# Altium project HIVE_BOARD.PrjPcb (part 4 of 6)

## Sheet HIVE_BOARD_CHANNEL_HW.SchDoc
size 647 x 419 mm; SheetNumber: 7; SheetTotal: 12; Sheet_Name: CHANNEL HARDWARE & CONNECTOR; Size: 11x17
Used 3 times, as channels TOP/CHAN 0A + 1A, TOP/CHAN 0B + 1B, TOP/CHAN 0C + 1C. Parts and nets are listed once, with the designators drawn on the sheet.
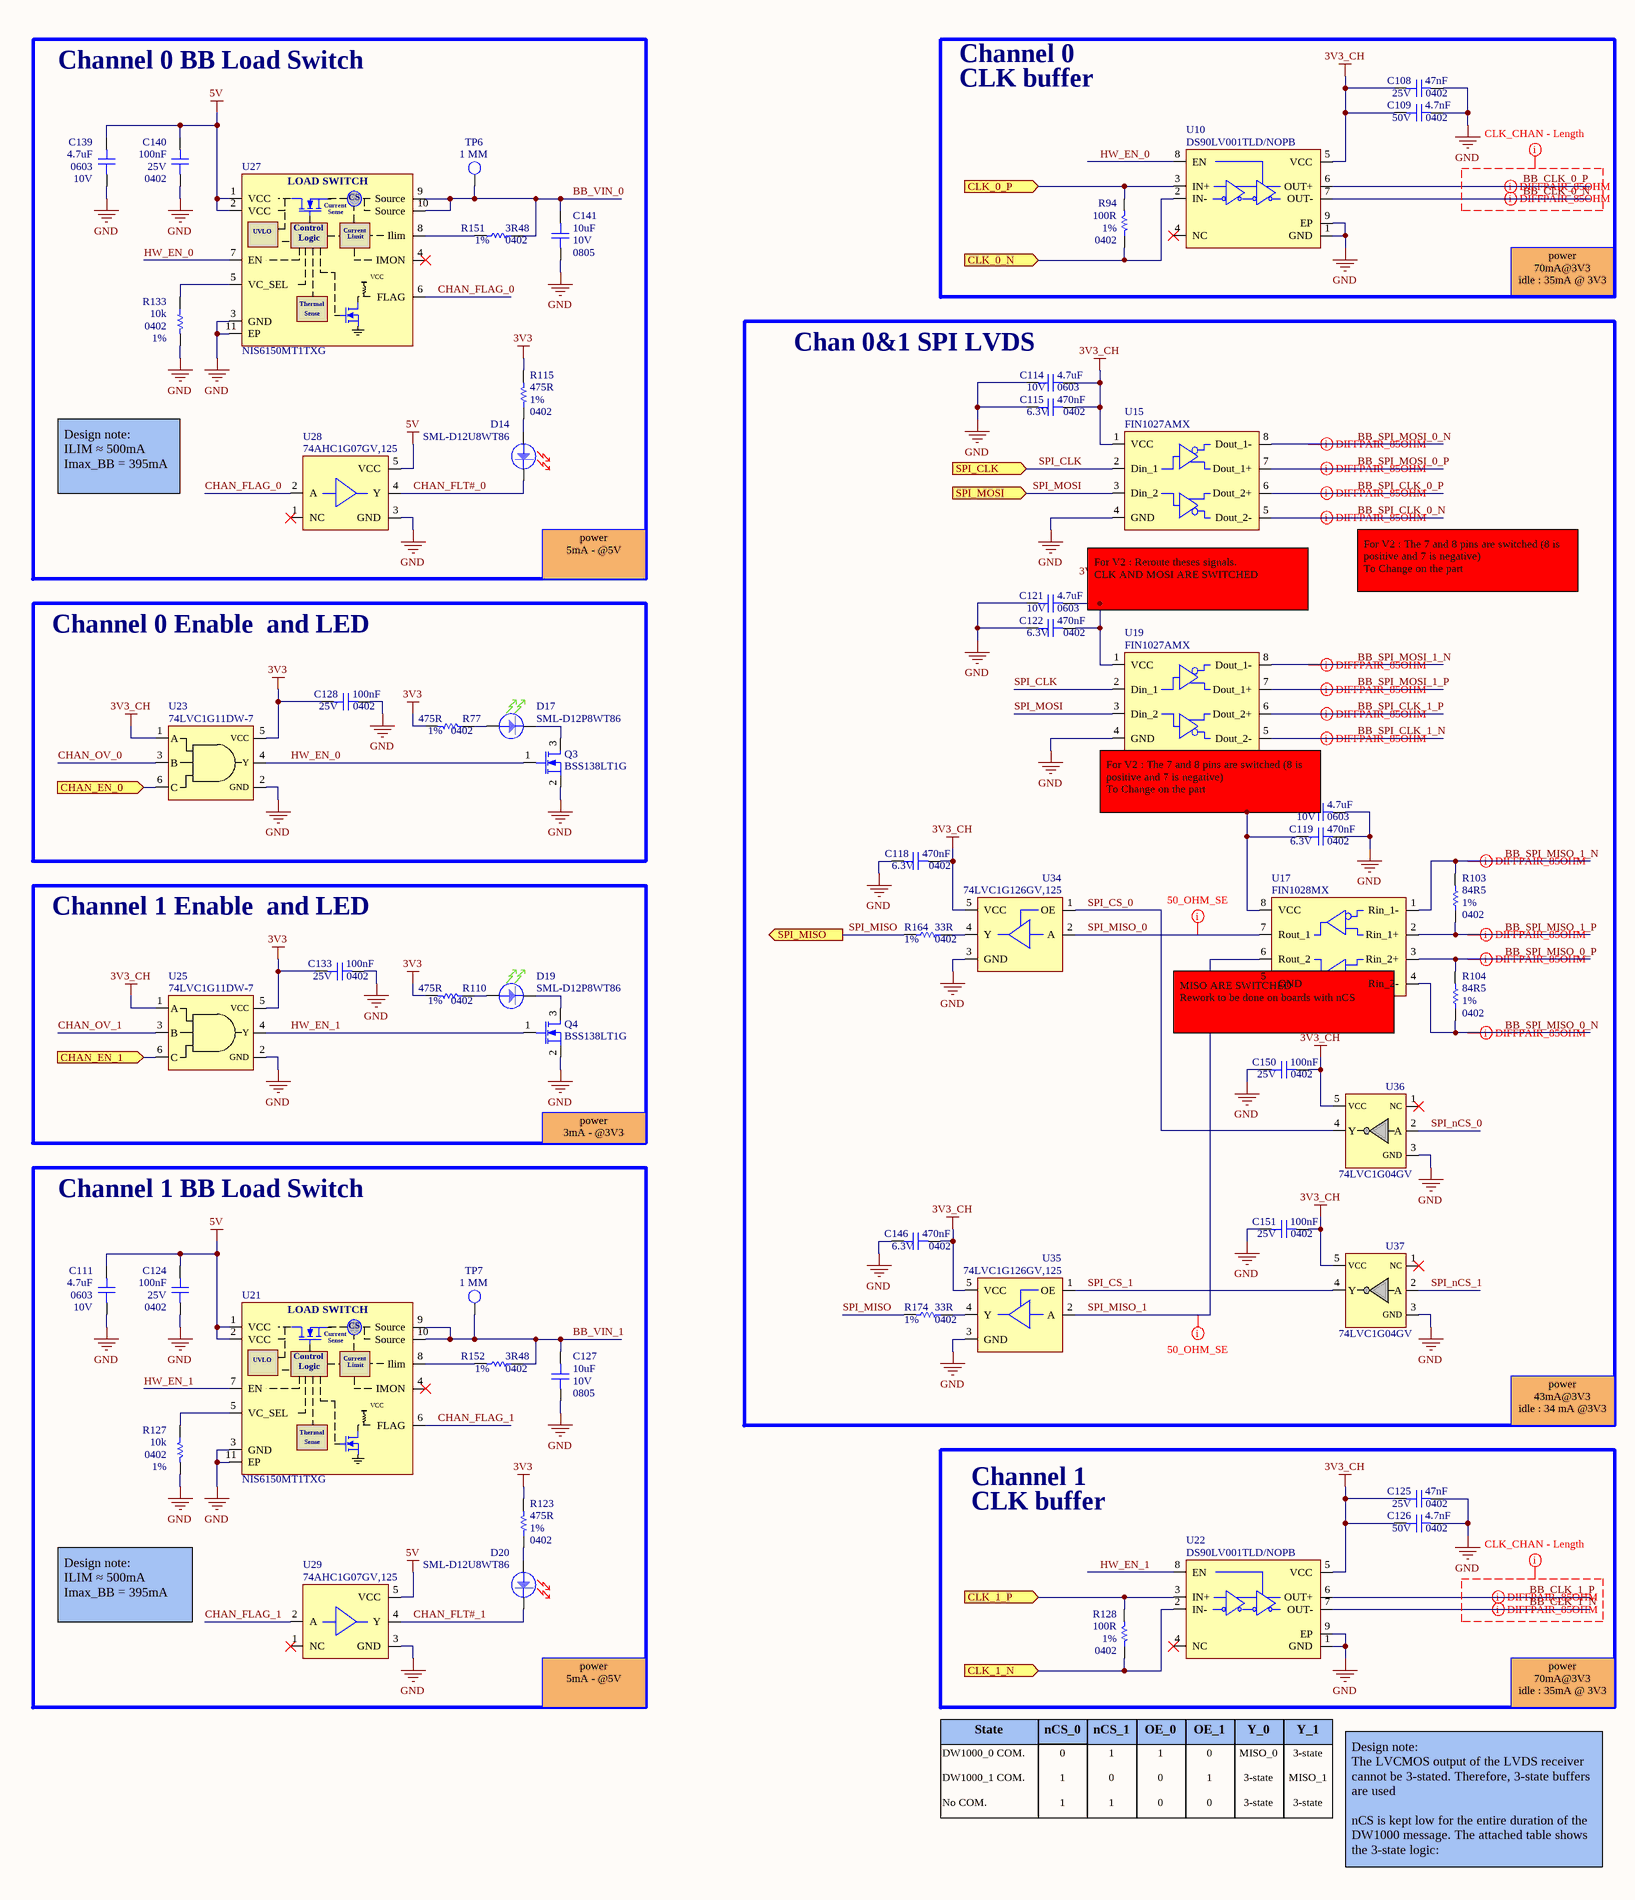
[diagram p5: HIVE_BOARD_CHANNEL_HW.SchDoc, left]
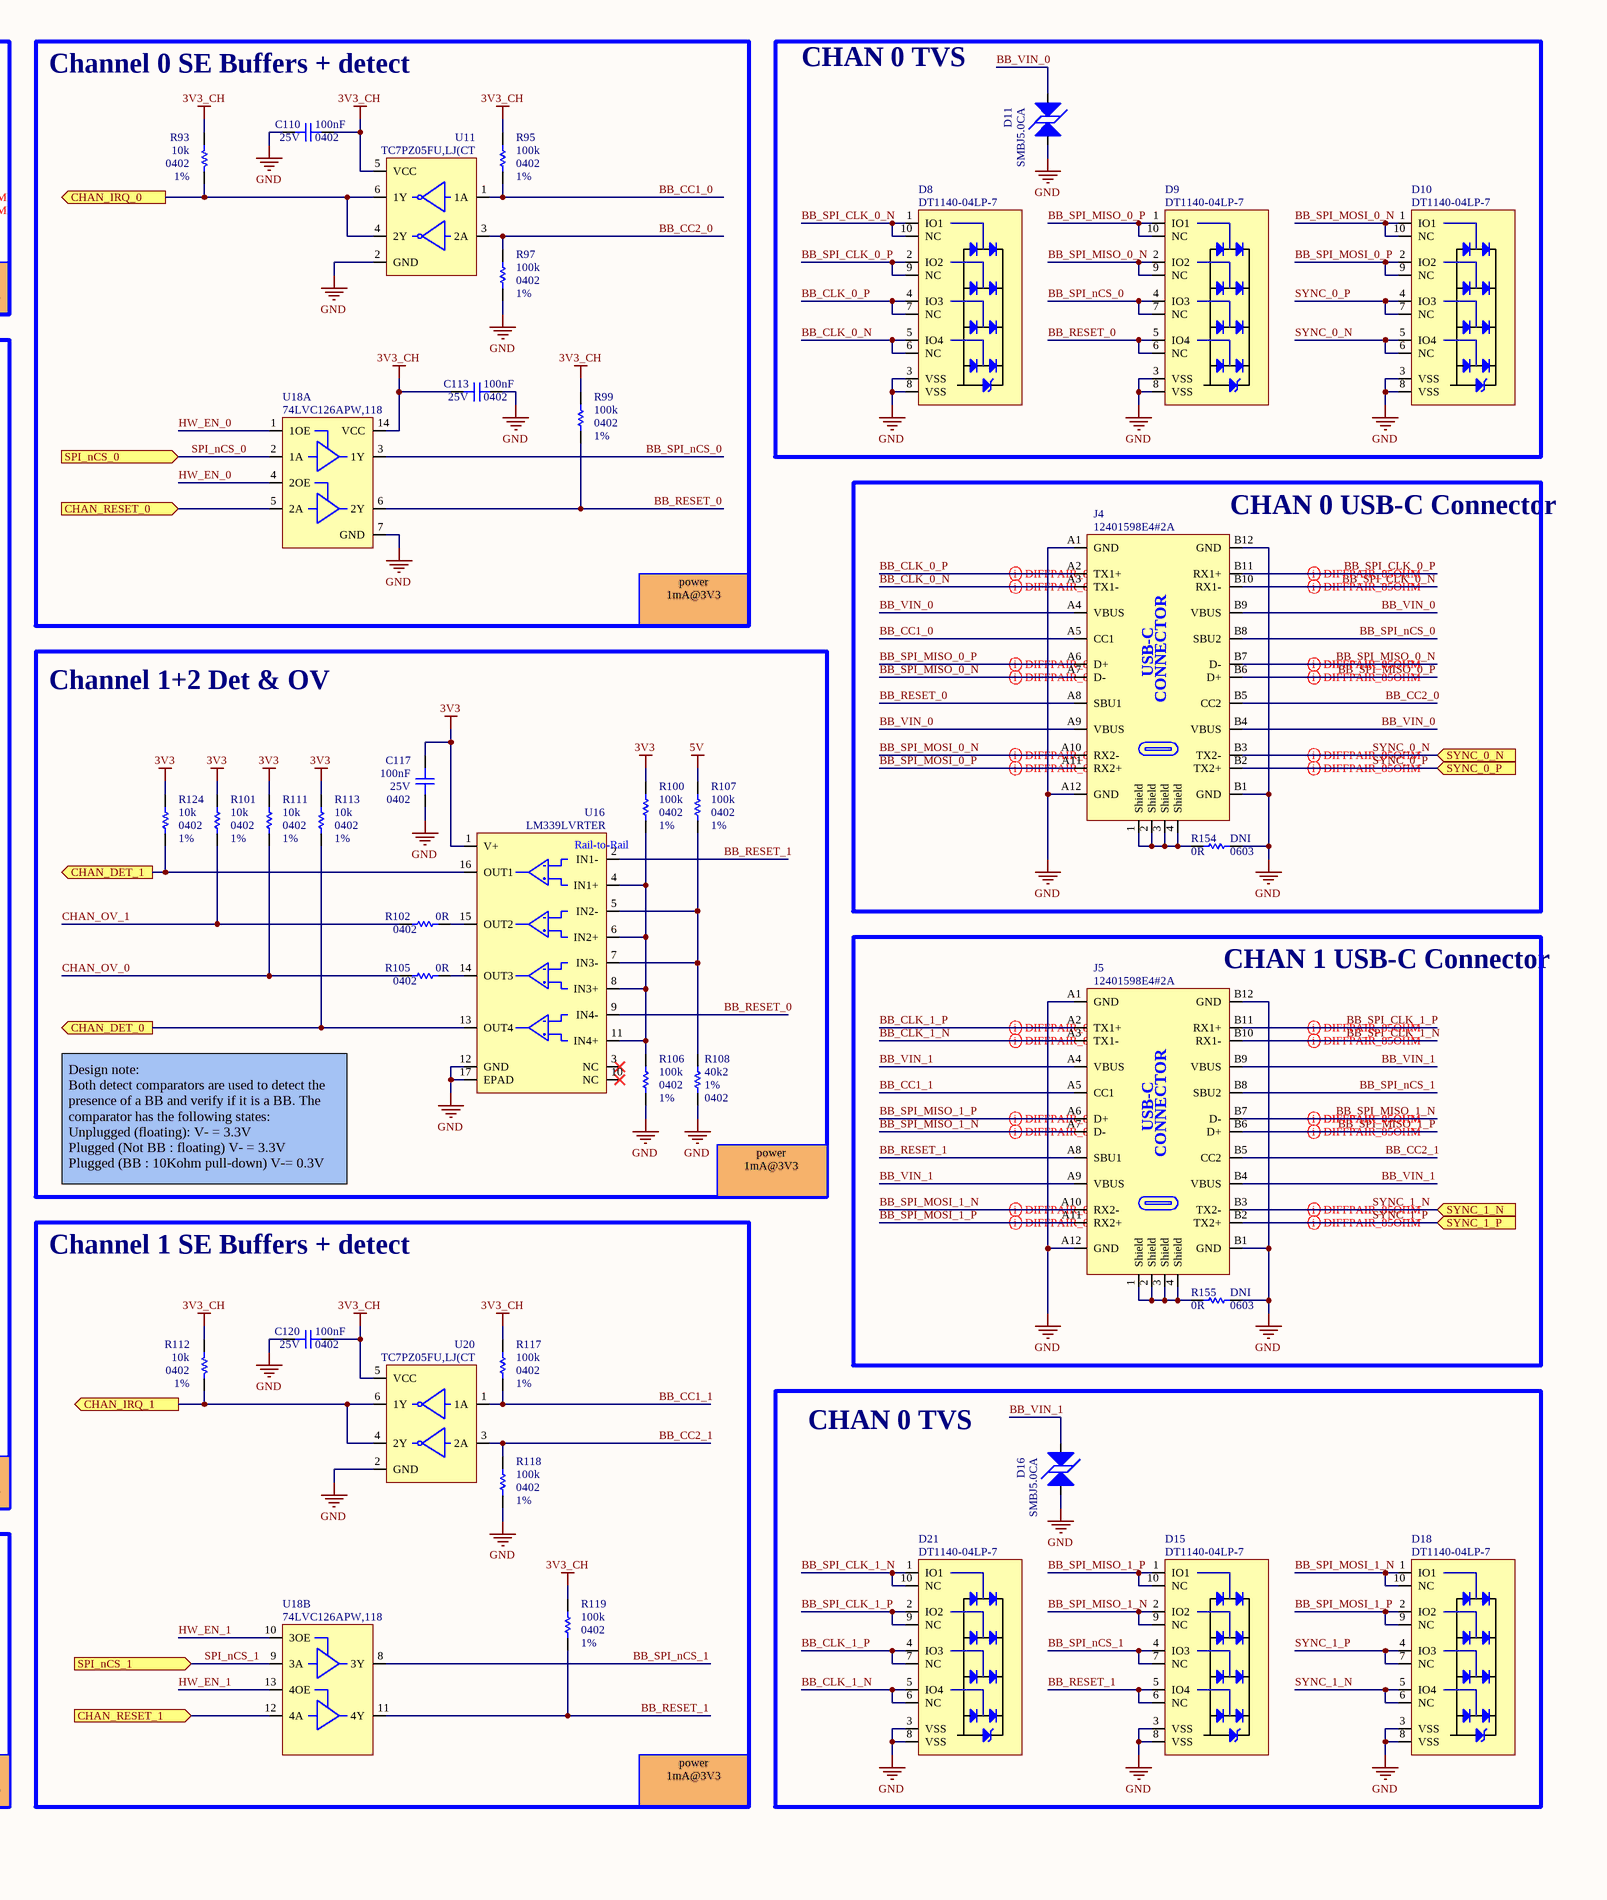
[diagram p6: HIVE_BOARD_CHANNEL_HW.SchDoc, right]

### Parts
C108  value 47nF  Package: 0402  Voltage Rating: 25V  [CAP_CER_0402]  (hidden comment: GRM155R71E473KA88J)
C109  value 4.7nF  Package: 0402  Voltage Rating: 50V  [CAP_CER_0402]  (hidden comment: CL05B472KB5VPNC)
C110  value 100nF  Package: 0402  Voltage Rating: 25V  [CAP_CER_0402]  (hidden comment: CGA2B3X7R1E104K050BB)
C111  value 4.7uF  Package: 0603  Voltage Rating: 10V  [CAP_CER_0603]  (hidden comment: CL10A475KP8NNNC)
C113  value 100nF  Package: 0402  Voltage Rating: 25V  [CAP_CER_0402]  (hidden comment: CGA2B3X7R1E104K050BB)
C114  value 4.7uF  Package: 0603  Voltage Rating: 10V  [CAP_CER_0603]  (hidden comment: CL10A475KP8NNNC)
C115  value 470nF  Package: 0402  Voltage Rating: 6.3V  [CAP_CER_0402]  (hidden comment: JMK105B7474KVHF)
C117  value 100nF  Package: 0402  Voltage Rating: 25V  [CAP_CER_0402]  (hidden comment: CGA2B3X7R1E104K050BB)
C118  value 470nF  Package: 0402  Voltage Rating: 6.3V  [CAP_CER_0402]  (hidden comment: JMK105B7474KVHF)
C119  value 470nF  Package: 0402  Voltage Rating: 6.3V  [CAP_CER_0402]  (hidden comment: JMK105B7474KVHF)
C120  value 100nF  Package: 0402  Voltage Rating: 25V  [CAP_CER_0402]  (hidden comment: CGA2B3X7R1E104K050BB)
C121  value 4.7uF  Package: 0603  Voltage Rating: 10V  [CAP_CER_0603]  (hidden comment: CL10A475KP8NNNC)
C122  value 470nF  Package: 0402  Voltage Rating: 6.3V  [CAP_CER_0402]  (hidden comment: JMK105B7474KVHF)
C124  value 100nF  Package: 0402  Voltage Rating: 25V  [CAP_CER_0402]  (hidden comment: CGA2B3X7R1E104K050BB)
C125  value 47nF  Package: 0402  Voltage Rating: 25V  [CAP_CER_0402]  (hidden comment: GRM155R71E473KA88J)
C126  value 4.7nF  Package: 0402  Voltage Rating: 50V  [CAP_CER_0402]  (hidden comment: CL05B472KB5VPNC)
C127  value 10uF  Package: 0805  Voltage Rating: 10V  [CAP_CER_0805]  (hidden comment: LMK212BJ106KG-T)
C128  value 100nF  Package: 0402  Voltage Rating: 25V  [CAP_CER_0402]  (hidden comment: CGA2B3X7R1E104K050BB)
C133  value 100nF  Package: 0402  Voltage Rating: 25V  [CAP_CER_0402]  (hidden comment: CGA2B3X7R1E104K050BB)
C139  value 4.7uF  Package: 0603  Voltage Rating: 10V  [CAP_CER_0603]  (hidden comment: CL10A475KP8NNNC)
C140  value 100nF  Package: 0402  Voltage Rating: 25V  [CAP_CER_0402]  (hidden comment: CGA2B3X7R1E104K050BB)
C141  value 10uF  Package: 0805  Voltage Rating: 10V  [CAP_CER_0805]  (hidden comment: LMK212BJ106KG-T)
C145  value 4.7uF  Package: 0603  Voltage Rating: 10V  [CAP_CER_0603]  (hidden comment: CL10A475KP8NNNC)
C146  value 470nF  Package: 0402  Voltage Rating: 6.3V  [CAP_CER_0402]  (hidden comment: JMK105B7474KVHF)
C150  value 100nF  Package: 0402  Voltage Rating: 25V  [CAP_CER_0402]  (hidden comment: CGA2B3X7R1E104K050BB)
C151  value 100nF  Package: 0402  Voltage Rating: 25V  [CAP_CER_0402]  (hidden comment: CGA2B3X7R1E104K050BB)
D8  DT1140-04LP-7  [TVS_DATA_DT1140-04LP-7]
D9  DT1140-04LP-7  [TVS_DATA_DT1140-04LP-7]
D10  DT1140-04LP-7  [TVS_DATA_DT1140-04LP-7]
D11  SMBJ5.0CA  [TVS_PWR_SMBJ5.0CA]
D14  SML-D12U8WT86  [LED_SML-D12U8WT86]
D15  DT1140-04LP-7  [TVS_DATA_DT1140-04LP-7]
D16  SMBJ5.0CA  [TVS_PWR_SMBJ5.0CA]
D17  SML-D12P8WT86  [LED_SML-D12P8WT86]
D18  DT1140-04LP-7  [TVS_DATA_DT1140-04LP-7]
D19  SML-D12P8WT86  [LED_SML-D12P8WT86]
D20  SML-D12U8WT86  [LED_SML-D12U8WT86]
D21  DT1140-04LP-7  [TVS_DATA_DT1140-04LP-7]
J4  12401598E4#2A  [CON_USB_3.2_TypeC_12401598E4#2A]
J5  12401598E4#2A  [CON_USB_3.2_TypeC_12401598E4#2A]
Q3  BSS138LT1G  [TRX_NMOS_BSS138LT1G]
Q4  BSS138LT1G  [TRX_NMOS_BSS138LT1G]
R77  value 475R  Tolerance: 1%  Package: 0402  [RES_0402]  (hidden comment: ERJ-2RKF4750X)
R93  value 10k  Tolerance: 1%  Package: 0402  [RES_0402]  (hidden comment: RC0402FR-0710KL)
R94  value 100R  Tolerance: 1%  Package: 0402  [RES_0402]  (hidden comment: RC0402FR-07100RP)
R95  value 100k  Tolerance: 1%  Package: 0402  [RES_0402]  (hidden comment: RC0402FR-07100KL)
R97  value 100k  Tolerance: 1%  Package: 0402  [RES_0402]  (hidden comment: RC0402FR-07100KL)
R99  value 100k  Tolerance: 1%  Package: 0402  [RES_0402]  (hidden comment: RC0402FR-07100KL)
R100  value 100k  Tolerance: 1%  Package: 0402  [RES_0402]  (hidden comment: RC0402FR-07100KL)
R101  value 10k  Tolerance: 1%  Package: 0402  [RES_0402]  (hidden comment: RC0402FR-0710KL)
R102  value 0R  Package: 0402  [RES_0402]  (hidden comment: RC0402FR-070RL)
R103  value 84R5  Tolerance: 1%  Package: 0402  [RES_0402]  (hidden comment: RC0402FR-0784R5L)
R104  value 84R5  Tolerance: 1%  Package: 0402  [RES_0402]  (hidden comment: RC0402FR-0784R5L)
R105  value 0R  Package: 0402  [RES_0402]  (hidden comment: RC0402FR-070RL)
R106  value 100k  Tolerance: 1%  Package: 0402  [RES_0402]  (hidden comment: RC0402FR-07100KL)
R107  value 100k  Tolerance: 1%  Package: 0402  [RES_0402]  (hidden comment: RC0402FR-07100KL)
R108  value 40k2  Tolerance: 1%  Package: 0402  [RES_0402]  (hidden comment: RC0402FR-0740K2L)
R110  value 475R  Tolerance: 1%  Package: 0402  [RES_0402]  (hidden comment: ERJ-2RKF4750X)
R111  value 10k  Tolerance: 1%  Package: 0402  [RES_0402]  (hidden comment: RC0402FR-0710KL)
R112  value 10k  Tolerance: 1%  Package: 0402  [RES_0402]  (hidden comment: RC0402FR-0710KL)
R113  value 10k  Tolerance: 1%  Package: 0402  [RES_0402]  (hidden comment: RC0402FR-0710KL)
R115  value 475R  Tolerance: 1%  Package: 0402  [RES_0402]  (hidden comment: ERJ-2RKF4750X)
R117  value 100k  Tolerance: 1%  Package: 0402  [RES_0402]  (hidden comment: RC0402FR-07100KL)
R118  value 100k  Tolerance: 1%  Package: 0402  [RES_0402]  (hidden comment: RC0402FR-07100KL)
R119  value 100k  Tolerance: 1%  Package: 0402  [RES_0402]  (hidden comment: RC0402FR-07100KL)
R123  value 475R  Tolerance: 1%  Package: 0402  [RES_0402]  (hidden comment: ERJ-2RKF4750X)
R124  value 10k  Tolerance: 1%  Package: 0402  [RES_0402]  (hidden comment: RC0402FR-0710KL)
R127  value 10k  Tolerance: 1%  Package: 0402  [RES_0402]  (hidden comment: RC0402FR-0710KL)
R128  value 100R  Tolerance: 1%  Package: 0402  [RES_0402]  (hidden comment: RC0402FR-07100RP)
R133  value 10k  Tolerance: 1%  Package: 0402  [RES_0402]  (hidden comment: RC0402FR-0710KL)
R151  value 3R48  Tolerance: 1%  Package: 0402  [RES_0402]  (hidden comment: CRCW04023R48FKED)
R152  value 3R48  Tolerance: 1%  Package: 0402  [RES_0402]  (hidden comment: CRCW04023R48FKED)
R154  value 0R  Assembly Note: DNI  Package: 0603  [RES_0603]  (hidden comment: RC0603JR-070RL)
R155  value 0R  Assembly Note: DNI  Package: 0603  [RES_0603]  (hidden comment: RC0603JR-070RL)
R164  value 33R  Tolerance: 1%  Package: 0402  [RES_0402]  (hidden comment: RC0402FR-0733RL)
R174  value 33R  Tolerance: 1%  Package: 0402  [RES_0402]  (hidden comment: RC0402FR-0733RL)
TP6  1 MM  [TPO_SMD_ROUND_1MM]  (no BOM)
TP7  1 MM  [TPO_SMD_ROUND_1MM]  (no BOM)
U10  DS90LV001TLD/NOPB  [COM_BUF_DS90LV001TLD/NOPB]
U11  TC7PZ05FU,LJ(CT  [LOG_BUF_TC7PZ05FU,LJ(CT]
U15  FIN1027AMX  [COM_XCV_FIN1027AMCOM]
U16  LM339LVRTER  [CMP_LM339LVRTER]
U17  FIN1028MX  [COM_XCV_FIN1028MX]
U18  74LVC126APW,118  [LOG_BUF_74LVC126APW,118]  (parts A,B of 2)
U19  FIN1027AMX  [COM_XCV_FIN1027AMCOM]
U20  TC7PZ05FU,LJ(CT  [LOG_BUF_TC7PZ05FU,LJ(CT]
U21  NIS6150MT1TXG  [POW_NIS6150MT1TXG]
U22  DS90LV001TLD/NOPB  [COM_BUF_DS90LV001TLD/NOPB]
U23  74LVC1G11DW-7  [LOG_AND_74LVC1G11DW-7]
U25  74LVC1G11DW-7  [LOG_AND_74LVC1G11DW-7]
U27  NIS6150MT1TXG  [POW_NIS6150MT1TXG]
U28  74AHC1G07GV,125  [LOG_BUF_ 74AHC1G07GV,125]
U29  74AHC1G07GV,125  [LOG_BUF_ 74AHC1G07GV,125]
U34  74LVC1G126GV,125  [LOG_BUF_ 74LVC1G126GV,125]
U35  74LVC1G126GV,125  [LOG_BUF_ 74LVC1G126GV,125]
U36  74LVC1G04GV  [LOG_INV_74LVC1G04GV]
U37  74LVC1G04GV  [LOG_INV_74LVC1G04GV]

### Blocks framed on the sheet
Channel 0 BB Load Switch: C139-C141 D14 R115 R133 R151 TP6 U27 U28
Channel 0 SE Buffers + detect: C110 C113 R93 R95 R97 R99 U11 U18
CHAN 0 TVS: D8-D11
Chan 0&1 SPI LVDS: C114 C115 C118 C119 C121 C122 C145 C146 C150 C151 R103 R104 R164 R174 U15 U17 U19 U34-U37
CHAN 0 USB-C Connector: J4 R154
Channel 0 Enable  and LED: C128 D17 Q3 R77 U23
Channel 1+2 Det & OV: C117 R100-R102 R105-R108 R111 R113 R124 U16
Channel 1 Enable  and LED: C133 D19 Q4 R110 U25
CHAN 1 USB-C Connector: J5 R155
Channel 1 SE Buffers + detect: C120 R112 R117-R119 U18 U20
Channel 1 BB Load Switch: C111 C124 C127 D20 R123 R127 R152 TP7 U21 U29
CHAN 0 TVS: D15 D16 D18 D21

### Ports
CHAN_DET_0 (out), CHAN_DET_1 (out), CHAN_EN_0 (in), CHAN_EN_1 (in), CHAN_IRQ_0 (out), CHAN_IRQ_1 (out), CHAN_RESET_0 (in), CHAN_RESET_1 (in), CLK_0_N (in), CLK_0_P (in), CLK_1_N (in), CLK_1_P (in), SPI_CLK (in), SPI_MISO (out), SPI_MOSI (in), SPI_nCS_0 (in), SPI_nCS_1 (in), SYNC_0_N (in), SYNC_0_P (in), SYNC_1_N (in), SYNC_1_P (in)

### Nets
3V3: C117.2 C128.2 C133.2 R77.2 R100.1 R101.1 R110.2 R111.1 R113.1 R115.2 R123.2 R124.1 U16.1(V+) U23.5(VCC) U25.5(VCC)
3V3_CH: C108.2 C109.2 C110.1 C113.2 C114.1 C115.1 C118.1 C119.1 C120.1 C121.1 C122.1 C125.2 C126.2 C145.1 C146.1 C150.1 C151.1 R93.1 R95.1 R99.1 R112.1 R117.1 R119.1 U10.5(VCC) U11.5(VCC) U15.1(VCC) U17.8(VCC) U18.14(VCC) U19.1(VCC) U20.5(VCC) U22.5(VCC) U23.1(A) U25.1(A) U34.5(VCC) U35.5(VCC) U36.5(VCC) U37.5(VCC)
5V: C111.1 C124.2 C139.1 C140.2 R107.1 U21.1(VCC) U21.2(VCC) U27.1(VCC) U27.2(VCC) U28.5(VCC) U29.5(VCC)
GND: C108.1 C109.1 C110.2 C111.2 C113.1 C114.2 C115.2 C117.1 C118.2 C119.2 C120.2 C121.2 C122.2 C124.1 C125.1 C126.1 C127.1 C128.1 C133.1 C139.2 C140.1 C141.1 C145.2 C146.2 C150.2 C151.2 D8.3(VSS) D8.8(VSS) D9.3(VSS) D9.8(VSS) D10.3(VSS) D10.8(VSS) D11.2 D15.3(VSS) D15.8(VSS) D16.2 D18.3(VSS) D18.8(VSS) D21.3(VSS) D21.8(VSS) J4.A1(GND) J4.A12(GND) J4.B1(GND) J4.B12(GND) J5.A1(GND) J5.A12(GND) J5.B1(GND) J5.B12(GND) Q3.2(S) Q4.2(S) R97.2 R106.2 R108.1 R118.2 R127.2 R133.2 R154.1 R155.1 U10.1(GND) U10.9(EP) U11.2(GND) U15.4(GND) U16.12(GND) U16.17(EPAD) U17.5(GND) U18.7(GND) U19.4(GND) U20.2(GND) U21.3(GND) U21.11(EP) U22.1(GND) U22.9(EP) U23.2(GND) U25.2(GND) U27.3(GND) U27.11(EP) U28.3(GND) U29.3(GND) U34.3(GND) U35.3(GND) U36.3(GND) U37.3(GND)
BB_CC1_0: J4.A5(CC1) R95.2 U11.1(1A)
BB_CC1_1: J5.A5(CC1) R117.2 U20.1(1A)
BB_CC2_0: J4.B5(CC2) R97.1 U11.3(2A)
BB_CC2_1: J5.B5(CC2) R118.1 U20.3(2A)
BB_CLK_0_N: D8.5(IO4) D8.6(NC) J4.A3(TX1-) U10.7(OUT-)
BB_CLK_0_P: D8.4(IO3) D8.7(NC) J4.A2(TX1+) U10.6(OUT+)
BB_CLK_1_N: D21.5(IO4) D21.6(NC) J5.A3(TX1-) U22.7(OUT-)
BB_CLK_1_P: D21.4(IO3) D21.7(NC) J5.A2(TX1+) U22.6(OUT+)
BB_RESET_0: D9.5(IO4) D9.6(NC) J4.A8(SBU1) R99.2 U16.9(IN4-) U18.6(2Y)
BB_RESET_1: D15.5(IO4) D15.6(NC) J5.A8(SBU1) R119.2 U16.2(IN1-) U18.11(4Y)
BB_SPI_CLK_0_N: D8.1(IO1) D8.10(NC) J4.B10(RX1-) U15.5(Dout_2-)
BB_SPI_CLK_0_P: D8.2(IO2) D8.9(NC) J4.B11(RX1+) U15.6(Dout_2+)
BB_SPI_CLK_1_N: D21.1(IO1) D21.10(NC) J5.B10(RX1-) U19.5(Dout_2-)
BB_SPI_CLK_1_P: D21.2(IO2) D21.9(NC) J5.B11(RX1+) U19.6(Dout_2+)
BB_SPI_MISO_0_N: D9.2(IO2) D9.9(NC) J4.A7(D-) J4.B7(D-) R104.1 U17.4(Rin_2-)
BB_SPI_MISO_0_P: D9.1(IO1) D9.10(NC) J4.A6(D+) J4.B6(D+) R104.2 U17.3(Rin_2+)
BB_SPI_MISO_1_N: D15.2(IO2) D15.9(NC) J5.A7(D-) J5.B7(D-) R103.2 U17.1(Rin_1-)
BB_SPI_MISO_1_P: D15.1(IO1) D15.10(NC) J5.A6(D+) J5.B6(D+) R103.1 U17.2(Rin_1+)
BB_SPI_MOSI_0_N: D10.1(IO1) D10.10(NC) J4.A10(RX2-) U15.8(Dout_1-)
BB_SPI_MOSI_0_P: D10.2(IO2) D10.9(NC) J4.A11(RX2+) U15.7(Dout_1+)
BB_SPI_MOSI_1_N: D18.1(IO1) D18.10(NC) J5.A10(RX2-) U19.8(Dout_1-)
BB_SPI_MOSI_1_P: D18.2(IO2) D18.9(NC) J5.A11(RX2+) U19.7(Dout_1+)
BB_SPI_nCS_0: D9.4(IO3) D9.7(NC) J4.B8(SBU2) U18.3(1Y)
BB_SPI_nCS_1: D15.4(IO3) D15.7(NC) J5.B8(SBU2) U18.8(3Y)
BB_VIN_0: C141.2 D11.1 J4.A4(VBUS) J4.A9(VBUS) J4.B4(VBUS) J4.B9(VBUS) R151.1 TP6.1 U27.9(Source) U27.10(Source)
BB_VIN_1: C127.2 D16.1 J5.A4(VBUS) J5.A9(VBUS) J5.B4(VBUS) J5.B9(VBUS) R152.1 TP7.1 U21.9(Source) U21.10(Source)
CHAN_DET_0: R113.2 U16.13(OUT4) ; port CHAN_DET_0
CHAN_DET_1: R124.2 U16.16(OUT1) ; port CHAN_DET_1
CHAN_EN_0: U23.6(C) ; port CHAN_EN_0
CHAN_EN_1: U25.6(C) ; port CHAN_EN_1
CHAN_FLAG_0: U27.6(FLAG) U28.2(A)
CHAN_FLAG_1: U21.6(FLAG) U29.2(A)
CHAN_FLT#_0: D14.K U28.4(Y)
CHAN_FLT#_1: D20.K U29.4(Y)
CHAN_IRQ_0: R93.2 U11.4(2Y) U11.6(1Y) ; port CHAN_IRQ_0
CHAN_IRQ_1: R112.2 U20.4(2Y) U20.6(1Y) ; port CHAN_IRQ_1
CHAN_OV_0: R105.2 R111.2 U23.3(B)
CHAN_OV_1: R101.2 R102.2 U25.3(B)
CHAN_RESET_0: U18.5(2A) ; port CHAN_RESET_0
CHAN_RESET_1: U18.12(4A) ; port CHAN_RESET_1
CLK_0_N: R94.1 U10.2(IN-) ; port CLK_0_N
CLK_0_P: R94.2 U10.3(IN+) ; port CLK_0_P
CLK_1_N: R128.1 U22.2(IN-) ; port CLK_1_N
CLK_1_P: R128.2 U22.3(IN+) ; port CLK_1_P
HW_EN_0: Q3.1(G) U10.8(EN) U18.1(1OE) U18.4(2OE) U23.4(Y) U27.7(EN)
HW_EN_1: Q4.1(G) U18.10(3OE) U18.13(4OE) U21.7(EN) U22.8(EN) U25.4(Y)
SPI_CLK: U15.2(Din_1) U19.2(Din_1) ; port SPI_CLK
SPI_CS_0: U34.1(OE) U36.4(Y)
SPI_CS_1: U35.1(OE) U37.4(Y)
SPI_MISO: R164.2 R174.2 ; port SPI_MISO
SPI_MISO_0: U17.7(Rout_1) U34.2(A)
SPI_MISO_1: U17.6(Rout_2) U35.2(A)
SPI_MOSI: U15.3(Din_2) U19.3(Din_2) ; port SPI_MOSI
SPI_nCS_0: U18.2(1A) U36.2(A) ; port SPI_nCS_0
SPI_nCS_1: U18.9(3A) U37.2(A) ; port SPI_nCS_1
SYNC_0_N: D10.5(IO4) D10.6(NC) J4.B3(TX2-) ; port SYNC_0_N
SYNC_0_P: D10.4(IO3) D10.7(NC) J4.B2(TX2+) ; port SYNC_0_P
SYNC_1_N: D18.5(IO4) D18.6(NC) J5.B3(TX2-) ; port SYNC_1_N
SYNC_1_P: D18.4(IO3) D18.7(NC) J5.B2(TX2+) ; port SYNC_1_P
NetD14_A: D14.A R115.1
NetD17_A: D17.A R77.1
NetD17_K: D17.K Q3.3(D)
NetD19_A: D19.A R110.1
NetD19_K: D19.K Q4.3(D)
NetD20_A: D20.A R123.1
NetJ4_1: J4.1(Shield) J4.2(Shield) J4.3(Shield) J4.4(Shield) R154.2
NetJ5_1: J5.1(Shield) J5.2(Shield) J5.3(Shield) J5.4(Shield) R155.2
NetR100_2: R100.2 R106.1 U16.4(IN1+) U16.6(IN2+) U16.8(IN3+) U16.11(IN4+)
NetR102_1: R102.1 U16.15(OUT2)
NetR105_1: R105.1 U16.14(OUT3)
NetR107_2: R107.2 R108.2 U16.5(IN2-) U16.7(IN3-)
NetR127_1: R127.1 U21.5(VC_SEL)
NetR133_1: R133.1 U27.5(VC_SEL)
NetR151_2: R151.2 U27.8(Ilim)
NetR152_2: R152.2 U21.8(Ilim)
NetR164_1: R164.1 U34.4(Y)
NetR174_1: R174.1 U35.4(Y)

Not connected (* = marked no-connect by the designer): U10 4(NC)*; U16 3(NC)* 10(NC)*; U21 4(IMON)*; U22 4(NC)*; U27 4(IMON)*; U28 1(NC)*; U29 1(NC)*; U36 1(NC)*; U37 1(NC)*

### Channels
TOP/CHAN 0A + 1A: designators end in A; ports CHAN_DET_0=CHAN_DET_0A CHAN_DET_1=CHAN_DET_1A CHAN_EN_0=CHAN_EN_0A CHAN_EN_1=CHAN_EN_1A CHAN_IRQ_0=CHAN_IRQ_0A CHAN_IRQ_1=CHAN_IRQ_1A CHAN_RESET_0=CHAN_RESET_0A CHAN_RESET_1=CHAN_RESET_1A CLK_0_N=CLK_0A_N CLK_0_P=CLK_0A_P CLK_1_N=CLK_1A_N CLK_1_P=CLK_1A_P SPI_CLK=SPI_CLK_A SPI_MISO=SPI_MISO_A SPI_MOSI=SPI_MOSI_A SPI_nCS_0=SPI_nCS_0A SPI_nCS_1=SPI_nCS_1A SYNC_0_N=SYNC_0A_N SYNC_0_P=SYNC_0A_P SYNC_1_N=SYNC_1A_N SYNC_1_P=SYNC_1A_P
TOP/CHAN 0B + 1B: designators end in B; ports CHAN_DET_0=CHAN_DET_0B CHAN_DET_1=CHAN_DET_1B CHAN_EN_0=CHAN_EN_0B CHAN_EN_1=CHAN_EN_1B CHAN_IRQ_0=CHAN_IRQ_0B CHAN_IRQ_1=CHAN_IRQ_1B CHAN_RESET_0=CHAN_RESET_0B CHAN_RESET_1=CHAN_RESET_1B CLK_0_N=CLK_0B_N CLK_0_P=CLK_0B_P CLK_1_N=CLK_1B_N CLK_1_P=CLK_1B_P SPI_CLK=SPI_CLK_B SPI_MISO=SPI_MISO_B SPI_MOSI=SPI_MOSI_B SPI_nCS_0=SPI_nCS_0B SPI_nCS_1=SPI_nCS_1B SYNC_0_N=SYNC_0B_N SYNC_0_P=SYNC_0B_P SYNC_1_N=SYNC_1B_N SYNC_1_P=SYNC_1B_P
TOP/CHAN 0C + 1C: designators end in C; ports CHAN_DET_0=CHAN_DET_0C CHAN_DET_1=CHAN_DET_1C CHAN_EN_0=CHAN_EN_0C CHAN_EN_1=CHAN_EN_1C CHAN_IRQ_0=CHAN_IRQ_0C CHAN_IRQ_1=CHAN_IRQ_1C CHAN_RESET_0=CHAN_RESET_0C CHAN_RESET_1=CHAN_RESET_1C CLK_0_N=CLK_0C_N CLK_0_P=CLK_0C_P CLK_1_N=CLK_1C_N CLK_1_P=CLK_1C_P SPI_CLK=SPI_CLK_C SPI_MISO=SPI_MISO_C SPI_MOSI=SPI_MOSI_C SPI_nCS_0=SPI_nCS_0C SPI_nCS_1=SPI_nCS_1C SYNC_0_N=SYNC_0C_N SYNC_0_P=SYNC_0C_P SYNC_1_N=SYNC_1C_N SYNC_1_P=SYNC_1C_P

### Layout directives
differential pair; differential pair class DIFF_85: BB_CLK_0_N_CHAN 0A + 1A, BB_CLK_0_P_CHAN 0A + 1A, BB_CLK_1_N_CHAN 0A + 1A, BB_CLK_1_P_CHAN 0A + 1A, BB_SPI_CLK_0_N_CHAN 0A + 1A, BB_SPI_CLK_0_P_CHAN 0A + 1A, BB_SPI_CLK_1_N_CHAN 0A + 1A, BB_SPI_CLK_1_P_CHAN 0A + 1A, BB_SPI_MISO_0_N_CHAN 0A + 1A, BB_SPI_MISO_0_P_CHAN 0A + 1A, BB_SPI_MISO_1_N_CHAN 0A + 1A, BB_SPI_MISO_1_P_CHAN 0A + 1A, BB_SPI_MOSI_0_N_CHAN 0A + 1A, BB_SPI_MOSI_0_P_CHAN 0A + 1A, BB_SPI_MOSI_1_N_CHAN 0A + 1A, BB_SPI_MOSI_1_P_CHAN 0A + 1A, SYNC_0A_N, SYNC_0A_P, SYNC_1A_N, SYNC_1A_P
differential pair: BB_SPI_MISO_0_N_CHAN 0A + 1A, BB_SPI_MISO_1_N_CHAN 0A + 1A
net class CLK_CHAN; rule Matched Net Lengths [Tolerance = 1mil]: BB_CLK_0_N, BB_CLK_0_P, BB_CLK_1_N, BB_CLK_1_P
net class SE_50: SPI_MISO_0_CHAN 0A + 1A, SPI_MISO_1_CHAN 0A + 1A

### Notes on the sheet
- Channel 0
- CLK buffer
- power
  70mA@3V3
  idle : 35mA @ 3V3
- Design note:
  ILIM ≈ 500mA
  Imax_BB = 395mA
- power
  5mA - @5V
- For V2 : Reroute theses signals.
  CLK AND MOSI ARE SWITCHED
- For V2 : The 7 and 8 pins are switched (8 is positive and 7 is negative)
  To Change on the part
- power
  1mA@3V3
- (near C145) For V2 : The 7 and 8 pins are switched (8 is positive and 7 is negative)
  To Change on the part
- (near U17) MISO ARE SWITCHED
  Rework to be done on boards with nCS
- Design note:
  Both detect comparators are used to detect the presence of a BB and verify if it is a BB. The comparator has the following states:
  Unplugged (floating): V- = 3.3V
  Plugged (Not BB : floating) V- = 3.3V
  Plugged (BB : 10Kohm pull-down) V-= 0.3V
- power
  3mA - @3V3
- power
  43mA@3V3
  idle : 34 mA @3V3
- Channel 1
- State
- nCS_0
- nCS_1
- OE_0
- OE_1
- Y_0
- Y_1
- DW1000_0 COM.
  DW1000_1 COM.
  No COM.
- 0
  1
  1
- 1
  0
  1
- 1
  0
  0
- 0
  1
  0
- MISO_0
  3-state
  3-state
- 3-state
  MISO_1
  3-state
- Design note:
  The LVCMOS output of the LVDS receiver cannot be 3-stated. Therefore, 3-state buffers are used
  nCS is kept low for the entire duration of the DW1000 message. The attached table shows the 3-state logic:
- Sheet Name
- Project Title
- Global Project
- Revision
- Size
- Date
- Group
- Sheet
- of
- Filename
- Designers
- (in symbol CMP_LM339LVRTER) Rail-to-Rail
- (in symbol CON_USB_3.2_TypeC_12401598E4#2A) USB-C; CONNECTOR
- (in symbol POW_NIS6150MT1TXG) LOAD SWITCH; CS; Current; Sense; UVLO; Control; Logic; Limit; Thermal

### Library data of the parts
C108 C125 = CAP_CER_GRM155R71E473KA88J: CAP - CER 47nF 25V X7R - 0402; Manufacturer #1: MURATA; GRAMS Lib Spec: 2.8c; Tolerance: 10%; Magnetic Material: Unknown; Polarized: No; Assembly Type: SMD; CreatedBy/Date: P. Marcoux 2020-02-05; Current Rating: *; HelpURL: https://ds.murata.co.jp/simsurfing/mlcc.html?partnumbers=%5B%22GRM155R71E473KA88%22%5D&oripartnumbers=%5B%22GRM155R71E473KA88J%22%5D&rgear=jomoqke&rgearinfo=ca; Manufacturer #2: *; Part Number #1: GRM155R71E473KA88J; Part Number #2: *; Power Max: *; Temperature: -55°C ~ 125°C; VerifiedBy: C.Paulin - 22/04/2020; Supplier 1: Digi-Key; Supplier Part Number 1: 490-6347-1-ND; Cryo: UNKNOWN
C109 C126 = CAP_CER_CL05B472KB5VPNC: CAP - CER 4700PF 50V X7R 0402; Manufacturer #1: Samsung Electro-Mechanics; GRAMS Lib Spec: 2.8; Tolerance: ±10%; Magnetic Material: Unknown; Polarized: NO; Assembly Type: SMD; CreatedBy/Date: Philippe Arsenault/ 2021-03-26; Current Rating: *; HelpURL: https://www.samsungsem.com/resources/file/global/support/product_catalog/MLCC.pdf; Manufacturer #2: *; Note: *; Part Number #1: CL05B472KB5VPNC; Part Number #2: *; Power Max: *; Temperature: -55°C ~ 125°C; Cryo: UNKNOWN; Supplier 1: Digi-Key; Supplier Part Number 1: 1276-6576-1-ND
C110 C113 C117 C120 C124 C128 C133 C140 C150 C151 = CAP_CER_CGA2B3X7R1E104K050BB: as C27 on sheet HIVE_BOARD_POWER; Assembly Type: SMD; CreatedBy/Date: Nicolas Roy 2018-11-07; Current Rating: *; HelpURL: https://product.tdk.com/info/en/catalog/datasheets/mlcc_automotive_general_en.pdf; Manufacturer #2: *; Note: *; Part Number #1: CGA2B3X7R1E104K050BB; Part Number #2: *; Power Max: *; Temperature: -55°C ~ 125°C; Tolerance: 10%; VerifiedBy: Nicolas V. (2019-01-22); Supplier 1: Digi-Key; Supplier Part Number 1: 445-6902-1-ND; Cryo: UNKNOWN
C111 C114 C121 C139 C145 = CAP_CER_CL10A475KP8NNNC: 4.7µF ±10% 10V Ceramic Capacitor X5R 0603; Manufacturer #1: Samsung Electro-Mechanics; GRAMS Lib Spec: 2.8; Magnetic Material: Unknown; Polarized: No; Tolerance: 10%; Current Rating: *; Power Max: *; HelpURL: https://www.samsungsem.com/resources/file/global/support/product_catalog/MLCC.pdf; CreatedBy/Date: Hubert Dube - 25/02/2021; VerifiedBy: Philippe Arsenault/2021-03-14; Temperature: -55°C ~ 85°C; Manufacturer #2: *; Note: *; Assembly Type: SMD; Part Number #2: *; Part Number #1: CL10A475KP8NNNC; Cryo: UNKNOWN; Supplier 1: Digi-Key; Supplier Part Number 1: 1276-1044-1-ND
C115 C118 C119 C122 C146 = CAP_CER_JMK105B7474KVHF: CAP - CER 470nF 6.3V X7R - 0402; Manufacturer #1: Taiyo Yuden; Tolerance: 10%; GRAMS Lib Spec: 2.8; Magnetic Material: UNKNOWN; Polarized: NO; Current Rating: *; Power Max: *; HelpURL: https://ds.yuden.co.jp/TYCOMPAS/ut/detail?pn=JMK105B7474KVHF%20&u=M; CreatedBy/Date: Nicolas (2019-06-21); VerifiedBy: Nicolas V. (2019-06-21); Temperature: -55°C ~ 125°C; Manufacturer #2: *; Note: *; Assembly Type: SMD; Part Number #2: *; Part Number #1: JMK105B7474KVHF; Supplier 1: Digi-Key; Supplier Part Number 1: 587-3765-1-ND; Cryo: UNKNOWN
C127 C141 = CAP_CER_LMK212BJ106KG-T: CAP - CER 10UF 10% 10V X5R - 0805; Manufacturer #1: Taiyo Yuden; GRAMS Lib Spec: 2.8; Magnetic Material: Unknown; Polarized: NO; Assembly Type: SMD; CreatedBy/Date: Caroline Paulin / 25 juillet 2018; Current Rating: *; HelpURL: https://www.yuden.co.jp/productdata/catalog/mlcc_all_e.pdf; Manufacturer #2: *; Note: *; Part Number #1: LMK212BJ106KG-T; Part Number #2: *; Power Max: *; Temperature: -55°C ~ 85°C; Tolerance: 10%; VerifiedBy: Nicolas V. (2019-01-22); Supplier 1: Digi-Key; Supplier Part Number 1: 587-1300-1-ND; Cryo: UNKNOWN
D8-D10 D15 D18 D21 = TVS_DATA_DT1140-04LP-7: TVS - DIODE 5.5V 10V - 10-UFDFN; Manufacturer #1: Diodes Incorporated; Value: 5.5V @ 1mA (Reverse Standoff); Voltage Rating: 6V (Breakdown); Current Rating: 6A (8/20µs); Power Max: 60W (8/20µs); GRAMS Lib Spec: 2.8; Note: Fooprint created from tpd4e05u06 (TI) for manufacturability (soldermask); Magnetic Material: UNKNOWN; Polarized: Yes; Tolerance: -; HelpURL: https://www.diodes.com/assets/Datasheets/DT1140-04LP.pdf; CreatedBy/Date: Joël Lemay 2019-11-20; VerifiedBy: C.Paulin - 21/11/2019; Temperature: -55°C~85°C; Package: 10-UFDFN; Manufacturer #2: -; Assembly Type: SMD; Part Number #2: -; Part Number #1: DT1140-04LP-7; Supplier 1: Digi-Key; Supplier Part Number 1: DT1140-04LP-7DICT-ND; Cryo: UNKNOWN; Solder Paste Type: UNKNOWN; Stencil Thickness (Recommended): UNKNOWN
D11 D16 = TVS_PWR_SMBJ5.0CA: as D3 on sheet HIVE_BOARD_POWER; Tolerance: *; HelpURL: http://www.littelfuse.com/~/media/electronics/datasheets/tvs_diodes/littelfuse_tvs_diode_smbj_datasheet.pdf.pdf; CreatedBy/Date: Jonathan Bouchard - 2019-03-22; VerifiedBy: Nicolas V. (2019-05-06); Temperature: -65°C ~ 150°C (TJ); Package: DO214AA; Manufacturer #2: *; Note: *; Assembly Type: SMD; Part Number #2: *; Part Number #1: SMBJ5.0CA; Supplier 1: Digi-Key; Supplier Part Number 1: SMBJ5.0CALFCT-ND; Cryo: UNKNOWN
D14 D20 = LED_SML-D12U8WT86: LED - RED DIFFUSED 0603 SMD - 0603; Manufacturer #1: Rohm Semiconductor; Current Rating: 1-20mA; Note: Operate at 2mA; Value: 620 nm (red); Voltage rating: 2.2V (Forward), 5V (max Reverse); Polarized: Yes; Magnetic Material: UNKNOWN; GRAMS Lib Spec: 2.8; Manufacturer #2: *; Power Max: *; Part Number #1: SML-D12U8WT86; Part Number #2: *; HelpURL: https://d1d2qsbl8m0m72.cloudfront.net/en/products/databook/datasheet/opto/led/chip_mono/sml-d12x8_d13x8-e.pdf; Supplier 1: Digi-Key; Supplier Part Number 1: 511-1580-1-ND; Assembly Type: SMD; Temperature: -40〜+85; Package: 0603; CreatedBy/Date: Olivier Bernard / 01/02/2018; Tolerance: *; VerifiedBy: Caroline Paulin / 6 juillet 2018; Cryo: UNKNOWN
D17 D19 = LED_SML-D12P8WT86: LED - GREEN DIFFUSED 0603 SMD - 0603; Manufacturer #1: Rohm Semiconductor; Current Rating: 1-20mA; Note: Operate at 2mA; Value: 560 nm (green); Voltage rating: 2.2V (Forward), 5V (max Reverse); Polarized: Yes; Magnetic Material: Unknown; GRAMS Lib Spec: 2.8; Manufacturer #2: *; Power Max: *; Part Number #1: SML-D12P8WT86; Part Number #2: *; HelpURL: https://d1d2qsbl8m0m72.cloudfront.net/en/products/databook/datasheet/opto/led/chip_mono/sml-d12x8_d13x8-e.pdf; Supplier 1: Digi-Key; Supplier Part Number 1: 511-1579-2-ND; Assembly Type: SMD; Temperature: -40 ~ 85 °C; Package: 0603; CreatedBy/Date: Keven Deslandes - 2018/11/21; Tolerance: *; VerifiedBy: Caroline Paulin - 13 février 2019; Cryo: UNKNOWN
J4 J5 = CON_USB_3.2_TypeC_12401598E4#2A: CON_USB - USB 3.2 Gen 2 (USB 3.1 Gen 2, Superspeed + (USB 3.1)) 24 pos Receptacle - R/A; Manufacturer #1: Amphenol ICC (Commercial Products); Value: USB 3.2 Type C; Current Rating: 5A total; GRAMS Lib Spec: 2.8; Magnetic Material: Unknown; Polarized: Yes; Voltage Rating: -; Power Max: -; HelpURL: https://www.amphenol-icc.com/media/wysiwyg/files/drawing/12401598xxx2a.pdf; CreatedBy/Date: Louis-Daniel Gaulin / 07-04-2021; VerifiedBy: Philippe Arsenault/2021-04-08; Temperature: max 105°C; Package: SMD + TH R/A; Assembly Type: SMD + TH; Part Number #1: 12401598E4#2A; Supplier 1: Digi-Key; Supplier Part Number 1: 12401598E4#2ACT-ND
Q3 Q4 = TRX_NMOS_BSS138LT1G: TRX - NMOS - 50V 200MA - SOT−23-3; Manufacturer #1: ON Semiconductor; GRAMS Lib Spec: 2.8; Magnetic Material: Unknown; Polarized: Yes; Power Max: 225mW; Assembly Type: SMD; CreatedBy/Date: Joel Lemay 2018-06-15; Current Rating: 200mA; HelpURL: http://www.onsemi.com/pub/Collateral/BSS138LT1-D.PDF; Manufacturer #2: *; Package: SOT-23-3; Part Number #1: BSS138LT1G; Part Number #2: *; Supplier 1: Digi-Key; Supplier Part Number 1: BSS138LT1GOSCT-ND; Temperature: -55°C ~ 150°C; Tolerance: *; Value: *; VerifiedBy: Caroline Paulin - 6 sept 2018; Voltage Rating: 50V; Cryo: UNKNOWN
R77 R110 R115 R123 = RES_ERJ-2RKF4750X: RES - 475R 1% 1/10W- 0402; Manufacturer #1: Panasonic Electronic Components; GRAMS Lib Spec: 2.8; Power Max: 1/10W; Magnetic Material: Unknown; Polarized: No; Voltage Rating: 50V; Assembly Type: SMD; CreatedBy/Date: Keven Deslandes 2018-10-17; Current Rating: *; HelpURL: https://industrial.panasonic.com/cdbs/www-data/pdf/RDA0000/AOA0000C304.pdf; Manufacturer #2: *; Part Number #1: ERJ-2RKF4750X; Part Number #2: *; Temperature: -55°C ~ 155°C; VerifiedBy: Carolilne Paulin - 18/12/2018; Supplier 1: Digi-Key; Supplier Part Number 1: P475LCT-ND; Cryo: UNKNOWN
R93 R101 R111-R113 R124 R127 R133 = RES_RC0402FR-0710KL: as R10 on sheet HIVE_BOARD_POWER; Assembly Type: SMD; CreatedBy/Date: Nicolas V. (2018-11-20); Current Rating: *; HelpURL: http://www.yageo.com/documents/recent/PYu-RC_Group_51_RoHS_L_9.pdf; Manufacturer #2: *; Note: *; Part Number #1: RC0402FR-0710KL; Part Number #2: *; Power Max: 1/16W; Temperature: -55°C ~ 155°C; VerifiedBy: Nicolas V. (2018-11-20); Supplier 1: Digi-Key; Supplier Part Number 1: 311-10.0KLRCT-ND; Cryo: UNKNOWN; Solder Paste Type: UNKNOWN; Stencil Thickness (Recommended): UNKNOWN
R94 R128 = RES_RC0402FR-07100RP: RES - 100R OHM 1% 1/16W - 0402; Manufacturer #1: Yageo; GRAMS Lib Spec: 2.8; Magnetic Material: YES; Polarized: NO; Voltage Rating: 50V; Cryo: UNKNOWN; Assembly Type: SMD; CreatedBy/Date: Jonathan Bouchard 2018-07-05; Current Rating: *; HelpURL: http://www.yageo.com/documents/recent/PYu-RC_Group_51_RoHS_L_9.pdf; Manufacturer #2: *; Note: *; Part Number #1: RC0402FR-07100RP; Part Number #2: *; Power Max: 1/16W; Temperature: -55°C ~ 155°C; VerifiedBy: Arnaud Samson 16-07-18; Supplier 1: Digi-Key; Supplier Part Number 1: YAG1248CT-ND
R95 R97 R99 R100 R106 R107 R117-R119 = RES_RC0402FR-07100KL: RES - 100K 1% 1/16W - 0402; Manufacturer #1: Yageo; GRAMS Lib Spec: 2.8; Magnetic Material: Unknown; Polarized: No; Voltage Rating: 50V; Assembly Type: SMD; CreatedBy/Date: Keven Deslandes 2018-10-19; Current Rating: *; HelpURL: http://www.yageo.com/documents/recent/PYu-RC_Group_51_RoHS_L_9.pdf; Manufacturer #2: *; Part Number #1: RC0402FR-07100KL; Part Number #2: *; Power Max: 1/16W; Temperature: -55°C ~ 155°C; VerifiedBy: Caroline Paulin - 18/12/2018; Supplier 1: Digi-Key; Supplier Part Number 1: 311-100KLRCT-ND; Cryo: UNKNOWN
R102 R105 = RES_RC0402FR-070RL: RES - 0R 1/16W 1A  - 0402; Manufacturer #1: Yageo; GRAMS Lib Spec: 2.8; Magnetic Material: Unknown; Polarized: No; Voltage Rating: 50V; Assembly Type: SMD; CreatedBy/Date: Keven Deslandes 2018-09-12; Current Rating: 1A; HelpURL: http://www.yageo.com/documents/recent/PYu-RC_Group_51_RoHS_L_10.pdf; Manufacturer #2: *; Note: *; Part Number #1: RC0402FR-070RL; Part Number #2: *; Power Max: 1/16W; Temperature: -55°C ~ 155°C; VerifiedBy: Caroline Paulin - 27 fév 2019; Supplier 1: Digi-Key; Supplier Part Number 1: 311-0.0LRCT-ND; Cryo: UNKNOWN
R103 R104 = RES_RC0402FR-0784R5L: RES - 84R5 1% 1/16W - 0402; Manufacturer #1: Yageo; GRAMS Lib Spec: 2.8c; Magnetic Material: Unknown; Polarized: No; Voltage Rating: 50V; Assembly Type: SMD; CreatedBy/Date: Philippe Arsenault/ 2021-03-31; Current Rating: *; HelpURL: https://www.yageo.com/upload/media/product/productsearch/datasheet/rchip/PYu-RC_Group_51_RoHS_L_11.pdf; Manufacturer #2: *; Note: *; Part Number #1: RC0402FR-0784R5L; Part Number #2: *; Power Max: 1/16W; Temperature: -55°C ~ 155°C; Supplier 1: Digi-Key; Supplier Part Number 1: YAG3246CT-ND
R108 = RES_RC0402FR-0740K2L: RES - 40.2K 1% 1/16W - 0402; Manufacturer #1: Yageo; GRAMS Lib Spec: 2.8; Magnetic Material: Unknown; Polarized: No; Voltage Rating: 50V; Assembly Type: SMD; CreatedBy/Date: Raphael Bouchard - 2019-08-09; Current Rating: -; HelpURL: http://www.yageo.com/documents/recent/PYu-RC_Group_51_RoHS_L_10.pdf; Manufacturer #2: -; Note: -; Part Number #1: RC0402FR-0740K2L; Part Number #2: -; Power Max: 1/16W; Temperature: -55°C ~ 155°C; VerifiedBy: C.Paulin - 15/08/2019; Supplier 1: Digi-Key; Supplier Part Number 1: 311-40.2KLRCT-ND; Cryo: UNKNOWN
R151 R152 = RES_CRCW04023R48FKED: RES - 3.48 R ±1% 1/16W -  0402; Manufacturer #1: Vishay Dale; GRAMS Lib Spec: 2.8c; Magnetic Material: Unknown; Polarized: No; Voltage Rating: 50V; Assembly Type: SMD; CreatedBy/Date: Louis-Daniel Gaulin / 2021-05-01; Current Rating: *; HelpURL: https://www.vishay.com/docs/20035/dcrcwe3.pdf; Manufacturer #2: *; Note: *; Part Number #1: CRCW04023R48FKED; Part Number #2: *; Power Max: 1/16W; Temperature: -55°C ~ 155°C; VerifiedBy: Philippe Arsenault/2021-05-10; Supplier 1: Digi-Key; Supplier Part Number 1: 541-3.48LLCT-ND
R154 R155 = RES_RC0603JR-070RL: RES - 0 ohm jumper 1/10W - 0603; Manufacturer #1: Yageo; GRAMS Lib Spec: 2.8; Magnetic Material: Unknown; Polarized: No; Assembly Type: SMD; CreatedBy/Date: L-P Gauthier 2018-10-30; Current Rating: *; HelpURL: http://www.yageo.com/documents/recent/PYu-RC_Group_51_RoHS_L_9.pdf; Manufacturer #2: *; Part Number #1: RC0603JR-070RL; Part Number #2: *; Power Max: 1/10W; Temperature: -55°C ~ 155°C; VerifiedBy: Caroline Paulin  - 5/11/2018; Voltage Rating: -; Supplier 1: Digi-Key; Supplier Part Number 1: 311-0.0GRCT-ND; Cryo: UNKNOWN
R164 R174 = RES_RC0402FR-0733RL: RES - 33 OHM 1% 1/16W - 0402; Manufacturer #1: Yageo; GRAMS Lib Spec: 2.8c; Magnetic Material: Unknown; Polarized: NO; Voltage Rating: 50V; Assembly Type: SMD; CreatedBy/Date: Louis-Daniel Gaulin/ 14/01/2020; Current Rating: *; HelpURL: https://www.yageo.com/upload/media/product/productsearch/datasheet/rchip/PYu-RC_Group_51_RoHS_L_10.pdf; Manufacturer #2: *; Note: *; Part Number #1: RC0402FR-0733RL; Part Number #2: *; Power Max: 1/16W; Temperature: -55°C ~ 155°C; VerifiedBy: C.Paulin - 21/01/2020; Supplier 1: Digi-Key; Supplier Part Number 1: 311-33.0LRCT-ND; Cryo: UNKNOWN
TP6 TP7 = TPO_SMD_ROUND_1MM: TPO - TEST POINT ROUND SMD PAD ONLY  - 1 MM; Magnetic Material: NO; GRAMS Lib Spec: 2.8; Cryo: UNKNOWN; Current Rating: *; Manufacturer #1: *; Manufacturer #2: *; Note: *; Power Max: *; Value: *; Part Number #1: *; Part Number #2: *; HelpURL: *; Polarized: *; Supplier 1: *; Assembly Type: NONE; Supplier Part Number 1: *; Package: 1 MM ROUND; CreatedBy/Date: Jonathan Bouchard 2018-07-17; Temperature: *; Tolerance: *; VerifiedBy: Arnaud Samson 23-07-18; Voltage Rating: *
U10 U22 = COM_BUF_DS90LV001TLD/NOPB: COM_BUF - ReDriver 1 Channel 800Mbps CML,LVDS,LVPECL to LVDS - / 8-WFDFN EP; Manufacturer #1: Texas Instruments; Voltage Rating: 3V ~ 3.6V; Current Rating: 70mA; GRAMS Lib Spec: 2.8; Magnetic Material: Unknown; Polarized: Yes; Value: LVDS; Power Max: -; HelpURL: https://www.ti.com/lit/ds/symlink/ds90lv001.pdf?HQS=dis-dk-null-digikeymode-dsf-pf-null-wwe&ts=1617891563599; CreatedBy/Date: Louis-Daniel Gaulin / 07-04-2021; VerifiedBy: Philippe Arsenault/2021-04-08; Temperature: -40°C ~ 85°C; Package: 8-WFDFN EP; Assembly Type: SMD; Part Number #1: DS90LV001TLD/NOPB; Supplier 1: Digi-Key; Supplier Part Number 1: DS90LV001TLD/NOPBCT-ND
U11 U20 = LOG_BUF_TC7PZ05FU,LJ(CT: LOG_BUF - DUAL Buffer inverting Open Drain - SOT-363; Manufacturer #1: Toshiba Semiconductor and Storage; Voltage Rating: 2V ~ 5.5V; Current Rating: 100mA VCC - 50mA output; Power Max: 200mW; GRAMS Lib Spec: 2.8; Magnetic Material: Unknown; Polarized: Yes; HelpURL: https://toshiba.semicon-storage.com/info/docget.jsp?did=30530&prodName=TC7PZ05FU; CreatedBy/Date: Louis-Daniel Gaulin / 14-04-2021; VerifiedBy: Philippe Arsenault/2021-04-14; Temperature: -40°C ~ 125°C (TA); Package: SOT-363; Assembly Type: SMD; Part Number #1: TC7PZ05FU,LJ(CT; Supplier 1: Digi-Key; Supplier Part Number 1: TC7PZ05FULJ(CTCT-ND
U15 U19 = COM_XCV_FIN1027AMX: COM_XCV - 3V3 LVCMOS to LVDS, 2 bits, High-SPEED, DIFF driver - SOIC-8; Manufacturer #1: ON Semiconductor; Value: 600Mbps; Voltage Rating: 3V ~ 3.6V; Current Rating: 17mA; Power Max: 56mW; GRAMS Lib Spec: 2.8; Magnetic Material: Unknown; Polarized: YES; HelpURL: https://www.onsemi.com/pdf/datasheet/fin1027a-d.pdf; CreatedBy/Date: Philippe Arsenault/2021-04-01; VerifiedBy: Louis-Daniel Gaulin - 05/04/2021; Temperature: -40°C ~ 85°C; Package: SOIC-8; Assembly Type: SMD; Part Number #1: FIN1027AMX; Supplier 1: Digi-Key; Supplier Part Number 1: FIN1027AMXCT-ND
U16 = CMP_LM339LVRTER: COMP - Quad Comparator General Purpose Open-Drain, Rail-to-Rail - 16-WQFN (3x3); Manufacturer #1: Texas instrument; Voltage Rating: 1.65V ~ 5.5V; Current Rating: 100mA@5V (SC); GRAMS Lib Spec: 2.8; Magnetic Material: Unknown; Polarized: Yes; Power Max: -; HelpURL: https://www.ti.com/lit/ds/symlink/lm339lv.pdf?ts=1618013735062; CreatedBy/Date: Philippe Arsenault/2021-04-10; VerifiedBy: Louis-Daniel Gaulin / 14-04-2021; Temperature: -40°C ~ 125°C (TA); Package: 16-WFQFN Exposed Pad; Assembly Type: SMD; Part Number #1: LM339LVRTER; Supplier 1: Digi-Key; Supplier Part Number 1: 296-LM339LVRTERCT-ND
U17 = COM_XCV_FIN1028MX: COM_XCV - 3V3 LVDS to LVCMOS, 2 bits, High-SPEED, DIFF receiver - SOIC-8; Manufacturer #1: ON Semiconductor; Value: 400Mbps; Voltage Rating: 3V ~ 3.6V; Current Rating: 9mA; Power Max: 30mW; GRAMS Lib Spec: 2.8; Magnetic Material: Unknown; Polarized: YES; HelpURL: https://www.onsemi.com/pdf/datasheet/fin1028-d.pdf; CreatedBy/Date: Philippe Arsenault/2021-04-01; VerifiedBy: Louis-Daniel Gaulin - 05/04/2021; Temperature: -40°C ~ 85°C; Package: SOIC-8; Assembly Type: SMD; Part Number #1: FIN1028MX; Supplier 1: Digi-Key; Supplier Part Number 1: FIN1028MXCT-ND
U18 = LOG_BUF_74LVC126APW,118: LOG_BUF - Quad Buffer non-inverting 3-States - 14-TSSOP; Manufacturer #1: Nexperia USA Inc.; Voltage Rating: 1.65V ~ 3.6V; Current Rating: 100mA (supply) - 24mA (output); Power Max: 500mW; GRAMS Lib Spec: 2.8; Magnetic Material: Unknown; Polarized: Yes; HelpURL: https://assets.nexperia.com/documents/data-sheet/74LVC126A.pdf; CreatedBy/Date: Louis-Daniel Gaulin / 11-04-2021; VerifiedBy: Philippe Arsenault/2021-04-14; Temperature: -40°C ~ 125°C (TA); Package: 14-TSSOP; Assembly Type: SMD; Part Number #1: 74LVC126APW,118; Supplier 1: Digi-Key; Supplier Part Number 1: 1727-5979-1-ND
U21 U27 = POW_NIS6150MT1TXG: POW -  Electronic Fuse Regulator 1A -  10-WDFNW; Manufacturer #1: On Semiconductor; Tolerance: See datasheet; Voltage Rating: -0.3V ~ 10V; GRAMS Lib Spec: 2.8c; Magnetic Material: Uknown; Polarized: Yes; Cryo: UNKNOWN; Value: *; Current Rating: 1A; Power Max: *; HelpURL: https://www.onsemi.com/pdf/datasheet/nis6150-d.pdf; CreatedBy/Date: Louis-Daniel Gaulin / 29-04-2021; VerifiedBy: Philippe Arsenault/2021-04-30; Temperature: -40°C ~ 125°C (TA); Package: 10-WDFNW; Manufacturer #2: *; Assembly Type: SMD; Part Number #2: *; Part Number #1: NIS6150MT1TXG; Supplier 1: DigiKey; Supplier Part Number 1: 488-NIS6150MT1TXGCT-ND
U23 U25 = LOG_AND_74LVC1G11DW-7: LOG - AND Gate, 1CH 3-INP - 6-TSSOP; Manufacturer #1: Diodes Incorporated; Voltage Rating: 1.65V ~ 5.5V; Current Rating: 32mA; GRAMS Lib Spec: 2.8c; Magnetic Material: Unknown; Polarized: Yes; Value: *; Tolerance: *; Power Max: *; HelpURL: https://www.diodes.com/assets/Datasheets/74LVC1G11.pdf; CreatedBy/Date: Louis-Daniel Gaulin / 26-02-2020; VerifiedBy: C.Paulin - 9/03/2020; Temperature: -40°C ~ 125°C; Package: 6-TSSOP; Manufacturer #2: *; Note: *; Assembly Type: SMD; Part Number #2: *; Part Number #1: 74LVC1G11DW-7; Supplier 1: Digi-Key; Supplier Part Number 1: 74LVC1G11DW-7CT-ND; Cryo: UNKNOWN
U28 U29 = LOG_BUF_74AHC1G07GV,125: LOG_BUF - Buffer non-inverting Open Drain - SC-74A; Manufacturer #1: Nexperia USA Inc.; Voltage Rating: 2V ~ 5.5V; Current Rating: 8mA; GRAMS Lib Spec: 2.8; Magnetic Material: Unknown; Polarized: Yes; Power Max: -; HelpURL: https://assets.nexperia.com/documents/data-sheet/74AHC1G07.pdf; CreatedBy/Date: Louis-Daniel Gaulin / 07-04-2021; VerifiedBy: Philippe Arsenault/2021-04-08; Temperature: -40°C ~ 125°C (TA); Package: SC-74A; Assembly Type: SMD; Part Number #1: 74AHC1G07GV,125; Supplier 1: Digi-Key; Supplier Part Number 1: 1727-6761-1-ND
U34 U35 = LOG_BUF_74LVC1G126GV,125: LOG_BUF - Buffer non-inverting 3-States - SC-74A; Manufacturer #1: Nexperia USA Inc.; Value: BUF 5V; Voltage Rating: 1.65V ~ 5.5V; Current Rating: 50mA; GRAMS Lib Spec: 2.8; Magnetic Material: Unknown; Polarized: Yes; Power Max: -; HelpURL: https://assets.nexperia.com/documents/data-sheet/74LVC1G126.pdf; CreatedBy/Date: Philippe Arsenault/2021-04-08; VerifiedBy: Louis-Daniel Gaulin / 11-04-2021; Temperature: -40°C ~ 125°C (TA); Package: SC-74A; Assembly Type: SMD; Part Number #1: 74LVC1G126GV,125; Supplier 1: Digi-Key; Supplier Part Number 1: 1727-6066-1-ND
U36 U37 = LOG_INV_74LVC1G04GV: LOG - INVERTER 1CH 1-INP - SOT-753; Manufacturer #1: Nexperia USA Inc.; Part Number #1: 74LVC1G04GV,125; Voltage Rating: 1.65V ~5.5V; GRAMS Lib Spec: 2.8; Magnetic Material: Unknown; Polarized: Yes; Value: *; Tolerance: *; Current Rating: -; Power Max: *; HelpURL: https://assets.nexperia.com/documents/data-sheet/74LVC1G04.pdf; CreatedBy/Date: Keven Deslandes - 2018-09-12; VerifiedBy: Caroline Paulin - 17/12/2018; Temperature: -40°C ~ 125°C; Package: SOT-753; Manufacturer #2: *; Assembly Type: SMD; Part Number #2: *; Supplier 1: Digi-Key; Supplier Part Number 1: 1727-3098-1-ND; Cryo: UNKNOWN

## Sheet HIVE_BOARD_MISC.SchDoc
size Tabloid; SheetNumber: 12; SheetTotal: 12; Sheet_Name: MISC; Size: 11x17
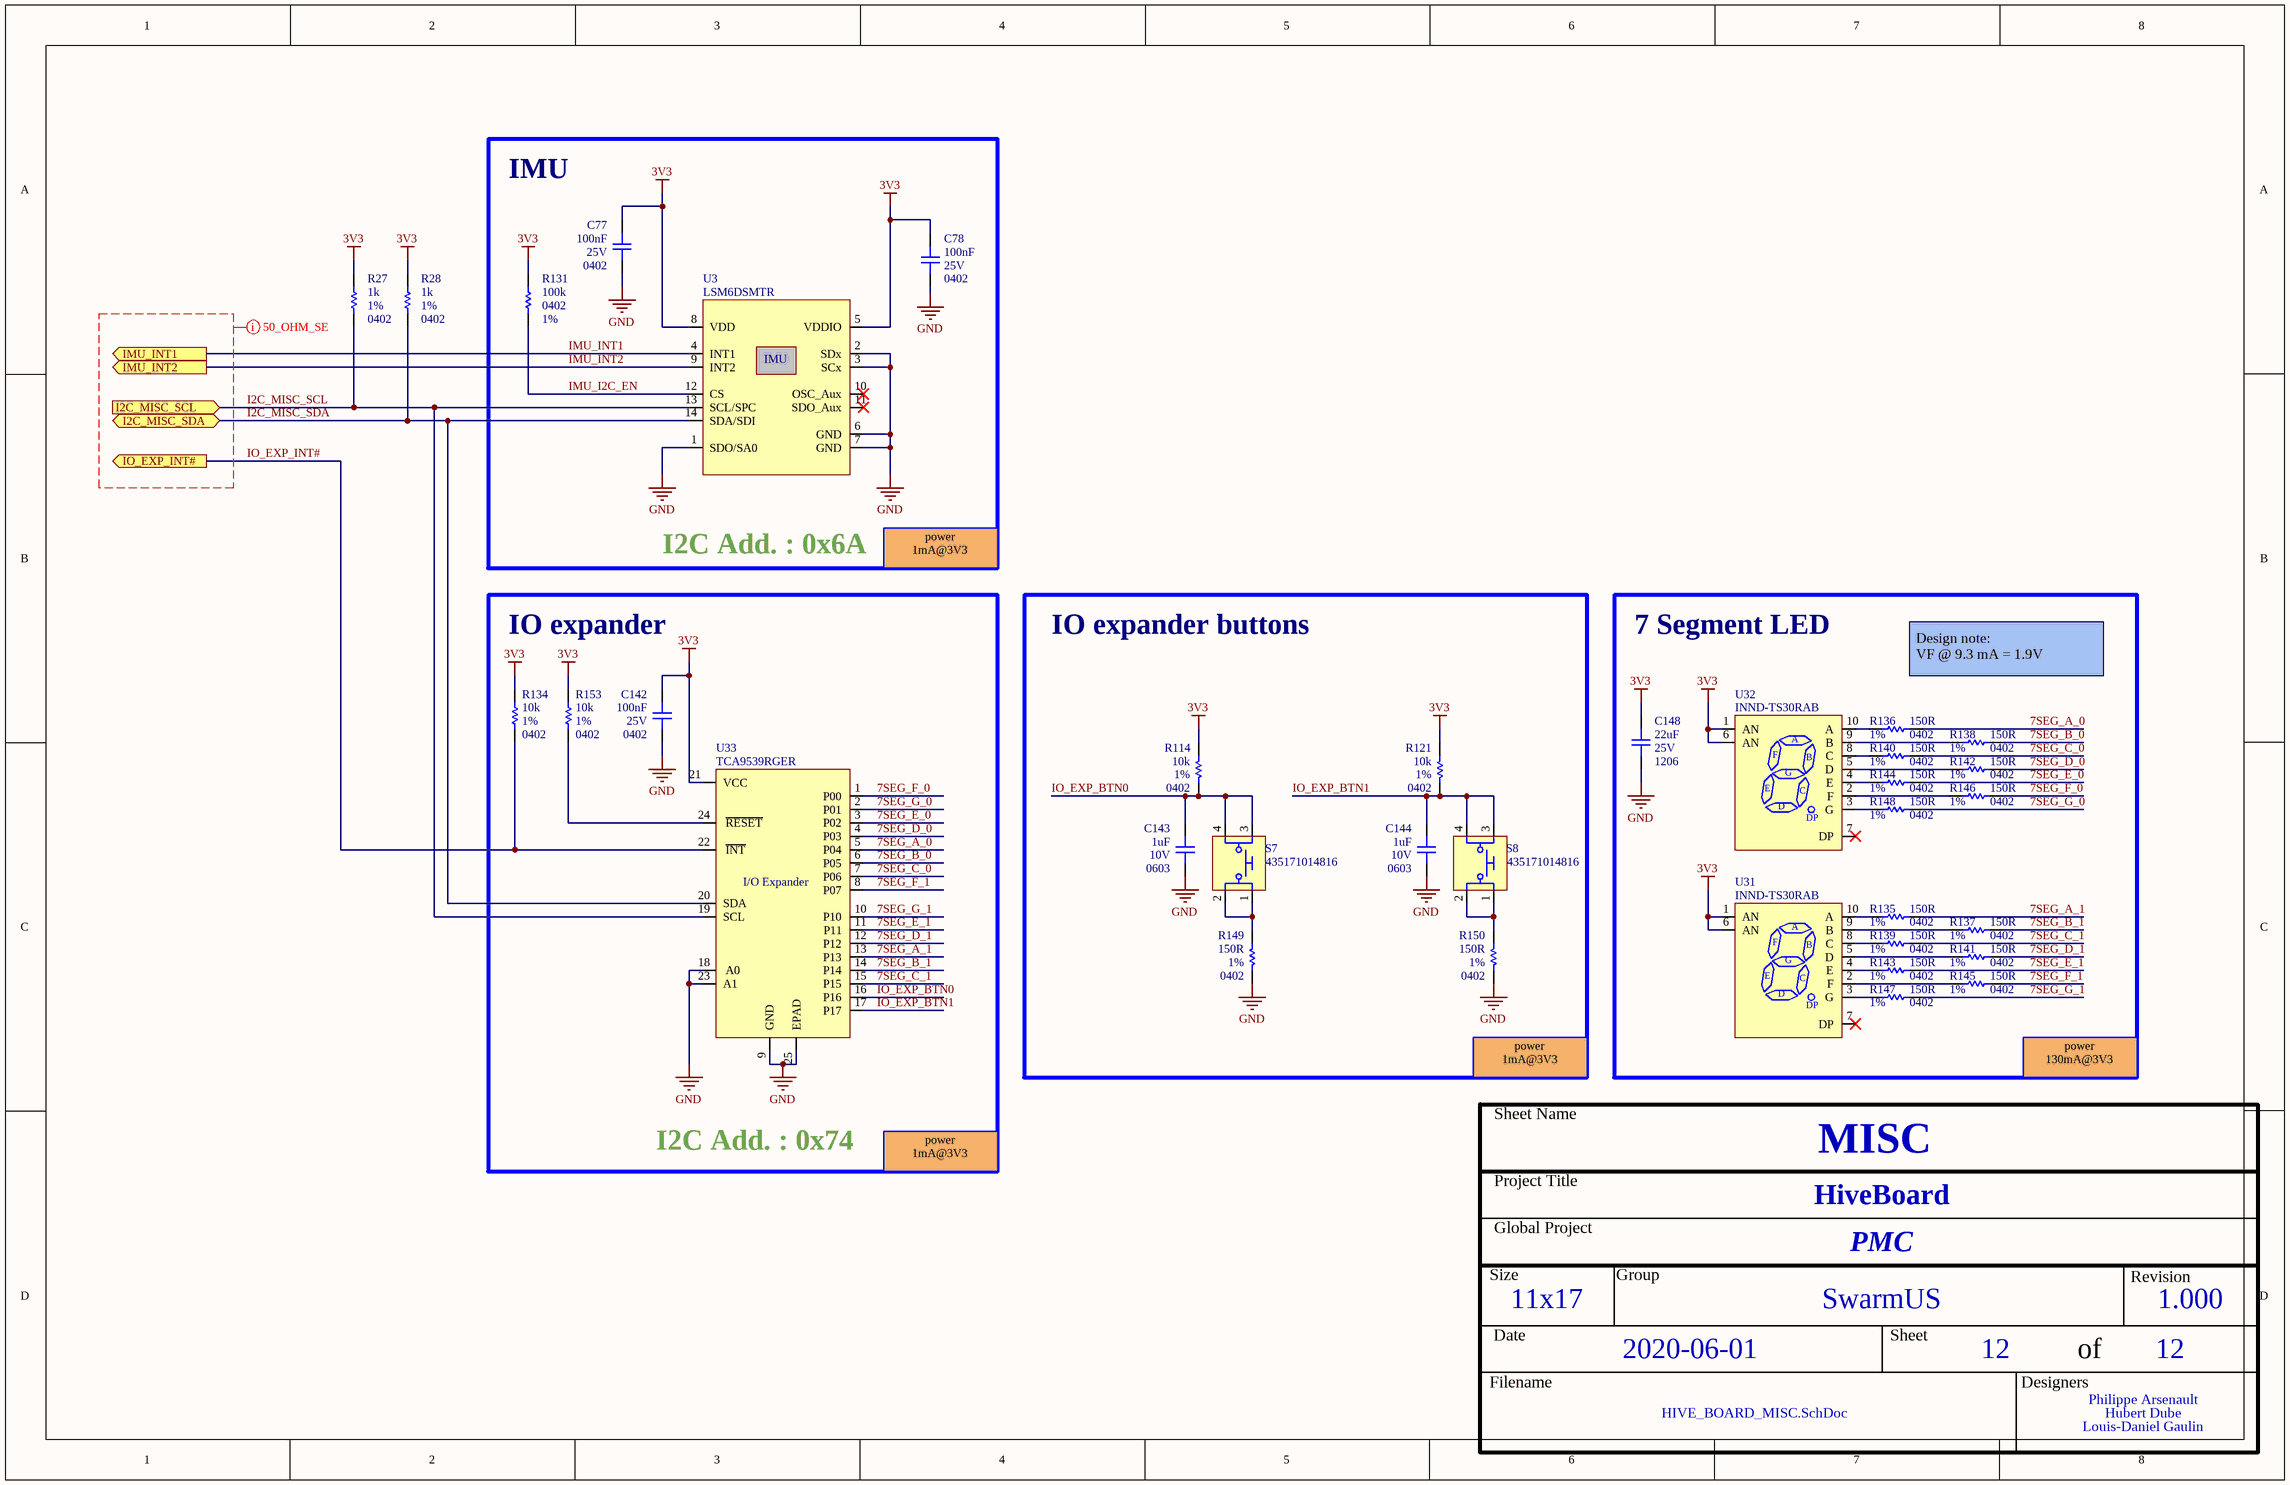
[diagram p7: HIVE_BOARD_MISC.SchDoc]

### Parts
C77  value 100nF  Package: 0402  Voltage Rating: 25V  [CAP_CER_0402]  (hidden comment: CGA2B3X7R1E104K050BB)
C78  value 100nF  Package: 0402  Voltage Rating: 25V  [CAP_CER_0402]  (hidden comment: CGA2B3X7R1E104K050BB)
C142  value 100nF  Package: 0402  Voltage Rating: 25V  [CAP_CER_0402]  (hidden comment: CGA2B3X7R1E104K050BB)
C143  value 1uF  Package: 0603  Voltage Rating: 10V  [CAP_CER_0603]  (hidden comment: C0603C105K8PACTU)
C144  value 1uF  Package: 0603  Voltage Rating: 10V  [CAP_CER_0603]  (hidden comment: C0603C105K8PACTU)
C148  value 22uF  Package: 1206  Voltage Rating: 25V  [CAP_CER_1206]  (hidden comment: CL31A226KAHNNNE)
R27  value 1k  Tolerance: 1%  Package: 0402  [RES_0402]  (hidden comment: RC0402FR-071KL)
R28  value 1k  Tolerance: 1%  Package: 0402  [RES_0402]  (hidden comment: RC0402FR-071KL)
R114  value 10k  Tolerance: 1%  Package: 0402  [RES_0402]  (hidden comment: RC0402FR-0710KL)
R121  value 10k  Tolerance: 1%  Package: 0402  [RES_0402]  (hidden comment: RC0402FR-0710KL)
R131  value 100k  Tolerance: 1%  Package: 0402  [RES_0402]  (hidden comment: RC0402FR-07100KL)
R134  value 10k  Tolerance: 1%  Package: 0402  [RES_0402]  (hidden comment: RC0402FR-0710KL)
R135  value 150R  Tolerance: 1%  Package: 0402  [RES_0402]  (hidden comment: RC0402FR-07150RL)
R136  value 150R  Tolerance: 1%  Package: 0402  [RES_0402]  (hidden comment: RC0402FR-07150RL)
R137  value 150R  Tolerance: 1%  Package: 0402  [RES_0402]  (hidden comment: RC0402FR-07150RL)
R138  value 150R  Tolerance: 1%  Package: 0402  [RES_0402]  (hidden comment: RC0402FR-07150RL)
R139  value 150R  Tolerance: 1%  Package: 0402  [RES_0402]  (hidden comment: RC0402FR-07150RL)
R140  value 150R  Tolerance: 1%  Package: 0402  [RES_0402]  (hidden comment: RC0402FR-07150RL)
R141  value 150R  Tolerance: 1%  Package: 0402  [RES_0402]  (hidden comment: RC0402FR-07150RL)
R142  value 150R  Tolerance: 1%  Package: 0402  [RES_0402]  (hidden comment: RC0402FR-07150RL)
R143  value 150R  Tolerance: 1%  Package: 0402  [RES_0402]  (hidden comment: RC0402FR-07150RL)
R144  value 150R  Tolerance: 1%  Package: 0402  [RES_0402]  (hidden comment: RC0402FR-07150RL)
R145  value 150R  Tolerance: 1%  Package: 0402  [RES_0402]  (hidden comment: RC0402FR-07150RL)
R146  value 150R  Tolerance: 1%  Package: 0402  [RES_0402]  (hidden comment: RC0402FR-07150RL)
R147  value 150R  Tolerance: 1%  Package: 0402  [RES_0402]  (hidden comment: RC0402FR-07150RL)
R148  value 150R  Tolerance: 1%  Package: 0402  [RES_0402]  (hidden comment: RC0402FR-07150RL)
R149  value 150R  Tolerance: 1%  Package: 0402  [RES_0402]  (hidden comment: RC0402FR-07150RL)
R150  value 150R  Tolerance: 1%  Package: 0402  [RES_0402]  (hidden comment: RC0402FR-07150RL)
R153  value 10k  Tolerance: 1%  Package: 0402  [RES_0402]  (hidden comment: RC0402FR-0710KL)
S7  435171014816  [SWI_TACT_435171014816]
S8  435171014816  [SWI_TACT_435171014816]
U3  LSM6DSMTR  [SEN_IMU_LSM6DSMTR]
U31  INND-TS30RAB  [LED_7SEG_INND-TS30RAB]
U32  INND-TS30RAB  [LED_7SEG_INND-TS30RAB]
U33  TCA9539RGER  [LOG_IOEXP_TCA9539RGER]

### Blocks framed on the sheet
IO expander buttons: C143 C144 R114 R121 R149 R150 S7 S8
7 Segment LED: C148 R135-R148 U31 U32

### Ports
I2C_MISC_SCL (in), I2C_MISC_SDA (bidir), IMU_INT1 (out), IMU_INT2 (out), IO_EXP_INT# (out)

### Nets
3V3: C77.1 C78.1 C142.1 C148.2 R27.1 R28.1 R114.2 R121.2 R131.1 R134.2 R153.2 U3.5(VDDIO) U3.8(VDD) U31.1(AN) U31.6(AN) U32.1(AN) U32.6(AN) U33.21(VCC)
GND: C77.2 C78.2 C142.2 C143.2 C144.2 C148.1 R149.1 R150.1 U3.1(SDO/SA0) U3.2(SDx) U3.3(SCx) U3.6(GND) U3.7(GND) U33.9(GND) U33.18(A0) U33.23(A1) U33.25(EPAD)
7SEG_A_0: R136.1 U33.5(P04)
7SEG_A_1: R135.1 U33.13(P13)
7SEG_B_0: R138.1 U33.6(P05)
7SEG_B_1: R137.1 U33.14(P14)
7SEG_C_0: R140.1 U33.7(P06)
7SEG_C_1: R139.1 U33.15(P15)
7SEG_D_0: R142.1 U33.4(P03)
7SEG_D_1: R141.1 U33.12(P12)
7SEG_E_0: R144.1 U33.3(P02)
7SEG_E_1: R143.1 U33.11(P11)
7SEG_F_0: R146.1 U33.1(P00)
7SEG_F_1: R145.1 U33.8(P07)
7SEG_G_0: R148.1 U33.2(P01)
7SEG_G_1: R147.1 U33.10(P10)
I2C_MISC_SCL: R27.2 U3.13(SCL/SPC) U33.19(SCL) ; port I2C_MISC_SCL
I2C_MISC_SDA: R28.2 U3.14(SDA/SDI) U33.20(SDA) ; port I2C_MISC_SDA
IMU_I2C_EN: R131.2 U3.12(CS)
IMU_INT1: U3.4(INT1) ; port IMU_INT1
IMU_INT2: U3.9(INT2) ; port IMU_INT2
IO_EXP_BTN0: C143.1 R114.1 S7.3 S7.4 U33.16(P16)
IO_EXP_BTN1: C144.1 R121.1 S8.3 S8.4 U33.17(P17)
IO_EXP_INT#: R134.1 U33.22(~{INT}) ; port IO_EXP_INT#
NetR135_2: R135.2 U31.10(A)
NetR136_2: R136.2 U32.10(A)
NetR137_2: R137.2 U31.9(B)
NetR138_2: R138.2 U32.9(B)
NetR139_2: R139.2 U31.8(C)
NetR140_2: R140.2 U32.8(C)
NetR141_2: R141.2 U31.5(D)
NetR142_2: R142.2 U32.5(D)
NetR143_2: R143.2 U31.4(E)
NetR144_2: R144.2 U32.4(E)
NetR145_2: R145.2 U31.2(F)
NetR146_2: R146.2 U32.2(F)
NetR147_2: R147.2 U31.3(G)
NetR148_2: R148.2 U32.3(G)
NetR149_2: R149.2 S7.1 S7.2
NetR150_2: R150.2 S8.1 S8.2
NetR153_1: R153.1 U33.24(~{RESET})

Not connected (* = marked no-connect by the designer): U3 10(OSC_Aux)* 11(SDO_Aux)*; U31 7(DP)*; U32 7(DP)*

### Layout directives
net class SE_50: (no net found under the mark)

### Notes on the sheet
- IMU
- I2C Add. : 0x6A
- power
  1mA@3V3
- IO expander
- Design note:
  VF @ 9.3 mA = 1.9V
- power
  130mA@3V3
- I2C Add. : 0x74
- Sheet Name
- Project Title
- Global Project
- Size
- Group
- Revision
- Date
- Sheet
- of
- Filename
- Designers
- (in symbol LOG_IOEXP_TCA9539RGER) I/O Expander
- (in symbol SEN_IMU_LSM6DSMTR) IMU

### Library data of the parts
C77 C78 C142 = CAP_CER_CGA2B3X7R1E104K050BB: CAP - CER 0.1µF 10% 25V X7R - 0402; Manufacturer #1: TDK Corporation; GRAMS Lib Spec: 2.8; Magnetic Material: Unknown; Polarized: NO; Assembly Type: SMD; CreatedBy/Date: Nicolas Roy 2018-11-07; Current Rating: *; HelpURL: https://product.tdk.com/info/en/catalog/datasheets/mlcc_automotive_general_en.pdf; Manufacturer #2: *; Note: *; Part Number #1: CGA2B3X7R1E104K050BB; Part Number #2: *; Power Max: *; Temperature: -55°C ~ 125°C; Tolerance: 10%; VerifiedBy: Nicolas V. (2019-01-22); Supplier 1: Digi-Key; Supplier Part Number 1: 445-6902-1-ND; Cryo: UNKNOWN
C143 C144 = CAP_CER_C0603C105K8PACTU: CAP - CER 1uF 10V 10% X5R - 0603; Manufacturer #1: KEMET; GRAMS Lib Spec: 2.8; Magnetic Material: Unknown; Polarized: NO; Tolerance: 10%; Current Rating: *; Power Max: *; HelpURL: https://content.kemet.com/datasheets/KEM_C1006_X5R_SMD.pdf; CreatedBy/Date: Hubert Dube - 21/07/20; VerifiedBy: Louis-Daniel Gaulin - 21/07/20; Temperature: -55°C ~ 85°C; Manufacturer #2: *; Assembly Type: SMD; Part Number #2: *; Part Number #1: C0603C105K8PACTU; Cryo: UNKNOWN; Supplier 1: Digi-Key; Supplier Part Number 1: 399-3118-1-ND
C148 = CAP_CER_CL31A226KAHNNNE: CAP - CER 22uF 10% 25V X5R - 1206; Manufacturer #1: Samsung Electro-Mechanics; GRAMS Lib Spec: 2.8; Magnetic Material: Unknown; Polarized: NO; Assembly Type: SMD; CreatedBy/Date: Philippe Arsenault/21 Janvier 2020; Current Rating: *; HelpURL: http://www.samsungsem.com/global/support/product-search/mlcc/1207445_4880.html; Manufacturer #2: *; Note: *; Part Number #1: CL31A226KAHNNNE; Part Number #2: 1276-3047-1-ND; Power Max: *; Temperature: -55°C ~ 85°C; Tolerance: 10%; VerifiedBy: C.Paulin - 28/01/2020; Supplier 1: Digi-Key; Supplier Part Number 1: 1276-3047-1-ND; Cryo: UNKNOWN
R27 R28 = RES_RC0402FR-071KL: RES - 1K OHM 1% 1/16W - 0402; Manufacturer #1: Yageo; GRAMS Lib Spec: 2.8; Magnetic Material: YES; Polarized: NO; Voltage Rating: 50V; Cryo: UNKNOWN; Assembly Type: SMD; CreatedBy/Date: Jonathan Bouchard 2018-07-05; Current Rating: *; HelpURL: http://www.yageo.com/documents/recent/PYu-RC_Group_51_RoHS_L_9.pdf; Manufacturer #2: *; Note: *; Part Number #1: RC0402FR-071KL; Part Number #2: *; Power Max: 1/16W; Temperature: -55°C ~ 155°C; VerifiedBy: Arnaud Samson 16-07-18; Supplier 1: Digi-Key; Supplier Part Number 1: 311-1.00KLRCT-ND
R114 R121 R134 R153 = RES_RC0402FR-0710KL: RES - 10K OHMS 1% 1/16W - 0402; Manufacturer #1: Yageo; GRAMS Lib Spec: 2.8; Magnetic Material: UNKNOWN; Polarized: NO; Voltage Rating: 50V; Assembly Type: SMD; CreatedBy/Date: Nicolas V. (2018-11-20); Current Rating: *; HelpURL: http://www.yageo.com/documents/recent/PYu-RC_Group_51_RoHS_L_9.pdf; Manufacturer #2: *; Note: *; Part Number #1: RC0402FR-0710KL; Part Number #2: *; Power Max: 1/16W; Temperature: -55°C ~ 155°C; VerifiedBy: Nicolas V. (2018-11-20); Supplier 1: Digi-Key; Supplier Part Number 1: 311-10.0KLRCT-ND; Cryo: UNKNOWN
R131 = RES_RC0402FR-07100KL: RES - 100K 1% 1/16W - 0402; Manufacturer #1: Yageo; GRAMS Lib Spec: 2.8; Magnetic Material: Unknown; Polarized: No; Voltage Rating: 50V; Assembly Type: SMD; CreatedBy/Date: Keven Deslandes 2018-10-19; Current Rating: *; HelpURL: http://www.yageo.com/documents/recent/PYu-RC_Group_51_RoHS_L_9.pdf; Manufacturer #2: *; Part Number #1: RC0402FR-07100KL; Part Number #2: *; Power Max: 1/16W; Temperature: -55°C ~ 155°C; VerifiedBy: Caroline Paulin - 18/12/2018; Supplier 1: Digi-Key; Supplier Part Number 1: 311-100KLRCT-ND; Cryo: UNKNOWN
R135-R150 = RES_RC0402FR-07150RL: RES - 150R 1% 1/16W - 0402; Manufacturer #1: Yageo; GRAMS Lib Spec: 2.8; Magnetic Material: Unknown; Polarized: No; Voltage Rating: 50V; Assembly Type: SMD; CreatedBy/Date: Jonathan Bouchard 2019-03-25; Current Rating: *; HelpURL: http://www.yageo.com/documents/recent/PYu-RC_Group_51_RoHS_L_10.pdf; Manufacturer #2: *; Part Number #1: RC0402FR-07150RL; Part Number #2: *; Power Max: 1/16W; Temperature: -55°C ~ 155°C; VerifiedBy: Nicolas V. (2019-05-02); Supplier 1: Digi-Key; Supplier Part Number 1: 311-150LRCT-ND; Cryo: UNKNOWN
S7 S8 = SWI_TACT_435171014816: SWI - SWITCH TACTILE SPST-NO 0.05A 12V -SMD; Manufacturer #1: Würth Elektronik; Current Rating: 50mA; Voltage rating: 12VDC; Polarized: No; Magnetic Material: UNKNOWN; GRAMS Lib Spec: 2.8; Manufacturer #2: *; Power Max: *; Value: SPST-NO; Part Number #1: 435171014816; Part Number #2: *; HelpURL: https://www.we-online.com/catalog/datasheet/435171014816.pdf; Supplier 1: Digi-Key; Supplier Part Number 1: 732-435171014816CT-ND; Assembly Type: SMD; Temperature: -40°C ~ 85°C; Package: SMD; CreatedBy/Date: Hubert Dube - 22/07/20; Tolerance: *; VerifiedBy: Louis-Daniel Gaulin / 12-11-2020; Cryo: UNKNOWN
U3 = SEN_IMU_LSM6DSMTR: SEN_IMU -  ACCEL/GYRO 6 Axis I2C/SPI - 14-VFLGA; Manufacturer #1: STMicroelectronics; Voltage Rating: 1.71V ~ 3.6V; Current Rating: 0.65mA; Power Max: 3mW; GRAMS Lib Spec: 2.7c; Magnetic Material: Unknown; Polarized: YES; Value: -; Tolerance: -; HelpURL: https://www.st.com/content/ccc/resource/technical/document/datasheet/76/27/cf/88/c5/03/42/6b/DM00218116.pdf/files/DM00218116.pdf/jcr:content/translations/en.DM00218116.pdf; CreatedBy/Date: Louis-Daniel Gaulin / 06-10-2020; VerifiedBy: Philippe Arsenault/2020-11-06; Temperature: -40°C ~ 85°C (TA); Package: 14-VFLGA; Manufacturer #2: -; Note: -; Assembly Type: SMD; Part Number #2: -; Part Number #1: LSM6DSMTR; Supplier 1: Digi-Key; Supplier Part Number 1: 497-16696-1-ND
U31 U32 = LED_7SEG_INND-TS30RAB: LED_7SEG  - LED Character and Numeric Red 7-Segment 1 Character Common Anode 2V - 10-TH; Current Rating: 20mA; Note: Operate at 10mA; Voltage rating: 2V (Vf); Polarized: Yes; Magnetic Material: Unknown; GRAMS Lib Spec: 2.8; Manufacturer #1: INND-TS30RAB; Manufacturer #2: *; Power Max: *; Part Number #2: *; HelpURL: http://www.inolux-corp.com/datasheet/Display/Through-Hole-Display/SingleDigit/INND-TS30%20Series_V1.0.pdf; Part Number #1: INND-TS30RAB; Supplier 1: Digi-Key; Supplier Part Number 1: 1830-1146-ND; Value: *; Assembly Type: TH; Temperature: -35°C ~ 85°C; Package: 10-TH; CreatedBy/Date: Louis-Daniel Gaulin / 10-05-2021; VerifiedBy: Philippe Arsenault/10-05-2021; Cryo: UNKNOWN
U33 = LOG_IOEXP_TCA9539RGER: LOG - 16-Bit I2C/SMBus, I/O Expander - 24-VQFN-EP; Manufacturer #1: Texas Instruments; Voltage rating: 1.65V ~ 5.5V; Polarized: Yes; Magnetic Material: Unknown; GRAMS Lib Spec: 2.8; Current Rating: *; Manufacturer #2: *; Power Max: *; Part Number #2: *; HelpURL: https://www.ti.com/lit/ds/symlink/tca9539.pdf?HQS=dis-dk-null-digikeymode-dsf-pf-null-wwe&ts=1620652560420; Part Number #1: TCA9539RGER; Supplier 1: Digi-Key; Supplier Part Number 1: 296-44209-1-ND; Value: *; Assembly Type: SMD; Temperature: -40°C ~ 85°C; Package: 24-VQFN-EP; CreatedBy/Date: Louis-Daniel Gaulin / 10-05-2021; VerifiedBy: Philippe Arsenault/2021-05-10; Cryo: UNKNOWN